# EAGLE design AR9721_eval (EAGLE 9.3.2)

## Sheet 1 of 3: AR9271
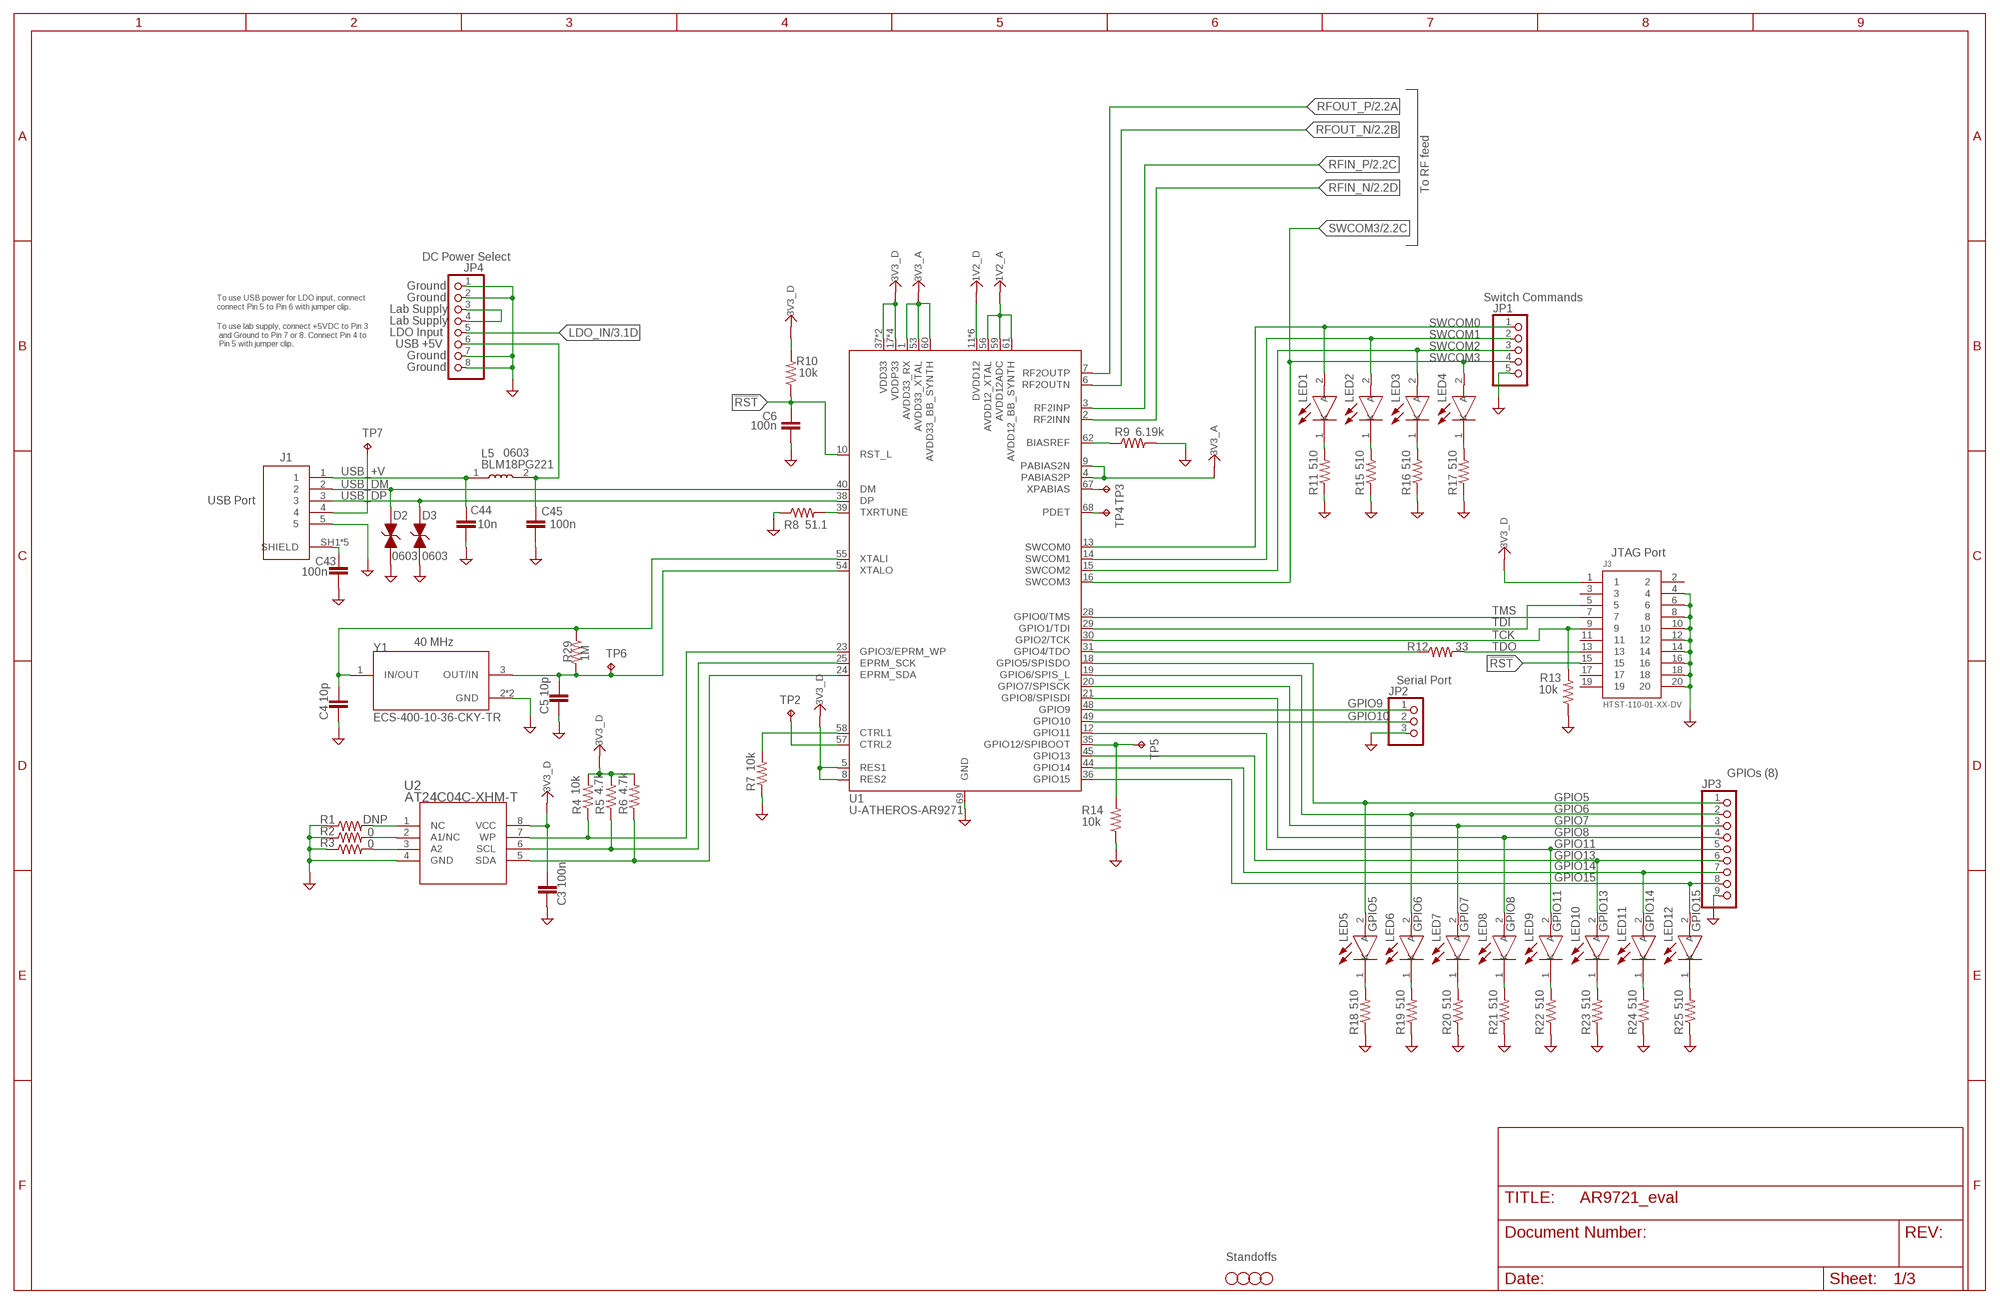
[diagram p0: schematic, sheet 1]

### Parts
C3  100n  C-EU0402-B-NOSILK  [.0402-B-NOSILK]
C4  10p  C-EU0402-B-NOSILK  [.0402-B-NOSILK]
C5  10p  C-EU0402-B-NOSILK  [.0402-B-NOSILK]
C6  100n  C-EU0402-B-NOSILK  [.0402-B-NOSILK]
C43  100n  C-EU0402-B-NOSILK  [.0402-B-NOSILK]
C44  10n  C-EU0402-B-NOSILK  [.0402-B-NOSILK]
C45  100n  C-EU0402-B-NOSILK  [.0402-B-NOSILK]
D2  PGB1010603MR  [ESD_PGB1010603MR]
D3  PGB1010603MR  [ESD_PGB1010603MR]
H1  STAND-OFFTIGHT  [STAND-OFF-TIGHT]
H2  STAND-OFFTIGHT  [STAND-OFF-TIGHT]
H3  STAND-OFFTIGHT  [STAND-OFF-TIGHT]
H4  STAND-OFFTIGHT  [STAND-OFF-TIGHT]
J1  UJ2-MIBH2-4-SMT-TR  [CUI_UJ2-MIBH2-4-SMT-TR]
J3  HTST-110-01-XX-DV  [HTST-110-01-XX-DV]
JP1  PINHD-1X5  [1X05]
JP2  PINHD-1X3  [1X03]
JP3  PINHD-1X9  [1X09]
JP4  PINHD-1X8  [1X08]
L5  BLM18PG221SH1D  [INDC1608X95]
LED1  LTST-C193KGKT-5A  [LEDC1607X80N]
LED2  LTST-C193KGKT-5A  [LEDC1607X80N]
LED3  LTST-C193KGKT-5A  [LEDC1607X80N]
LED4  LTST-C193KGKT-5A  [LEDC1607X80N]
LED5  LTST-C193KGKT-5A  [LEDC1607X80N]
LED6  LTST-C193KGKT-5A  [LEDC1607X80N]
LED7  LTST-C193KGKT-5A  [LEDC1607X80N]
LED8  LTST-C193KGKT-5A  [LEDC1607X80N]
LED9  LTST-C193KGKT-5A  [LEDC1607X80N]
LED10  LTST-C193KGKT-5A  [LEDC1607X80N]
LED11  LTST-C193KGKT-5A  [LEDC1607X80N]
LED12  LTST-C193KGKT-5A  [LEDC1607X80N]
R1  DNP  R-US_0402-A-NOSILK  [.0402-A-NOSILK]
R2  0  R-US_0402-A-NOSILK  [.0402-A-NOSILK]
R3  0  R-US_0402-A-NOSILK  [.0402-A-NOSILK]
R4  10k  R-US_0402-A-NOSILK  [.0402-A-NOSILK]
R5  4.7k  R-US_0402-A-NOSILK  [.0402-A-NOSILK]
R6  4.7k  R-US_0402-A-NOSILK  [.0402-A-NOSILK]
R7  10k  R-US_0402-A-NOSILK  [.0402-A-NOSILK]
R8  51.1  R-US_0402-A-NOSILK  [.0402-A-NOSILK]
R9  6.19k  R-US_0402-A-NOSILK  [.0402-A-NOSILK]
R10  10k  R-US_0402-A-NOSILK  [.0402-A-NOSILK]
R11  510  R-US_0402-A-NOSILK  [.0402-A-NOSILK]
R12  33  R-US_0402-A-NOSILK  [.0402-A-NOSILK]
R13  10k  R-US_0402-A-NOSILK  [.0402-A-NOSILK]
R14  10k  R-US_0402-A-NOSILK  [.0402-A-NOSILK]
R15  510  R-US_0402-A-NOSILK  [.0402-A-NOSILK]
R16  510  R-US_0402-A-NOSILK  [.0402-A-NOSILK]
R17  510  R-US_0402-A-NOSILK  [.0402-A-NOSILK]
R18  510  R-US_0402-A-NOSILK  [.0402-A-NOSILK]
R19  510  R-US_0402-A-NOSILK  [.0402-A-NOSILK]
R20  510  R-US_0402-A-NOSILK  [.0402-A-NOSILK]
R21  510  R-US_0402-A-NOSILK  [.0402-A-NOSILK]
R22  510  R-US_0402-A-NOSILK  [.0402-A-NOSILK]
R23  510  R-US_0402-A-NOSILK  [.0402-A-NOSILK]
R24  510  R-US_0402-A-NOSILK  [.0402-A-NOSILK]
R25  510  R-US_0402-A-NOSILK  [.0402-A-NOSILK]
R29  1M  R-US_0402-A-NOSILK  [.0402-A-NOSILK]
TP2  TPTP06R  [TP06R]
TP3  TPTP06R  [TP06R]
TP4  TPTP06R  [TP06R]
TP5  TPTP06R  [TP06R]
TP6  TPTP06R  [TP06R]
TP7  TPTP06R  [TP06R]
U1  U-ATHEROS-AR9271  [QFN-68]
U2  AT24C04C-XHM-T  [8X]
Y1  ECS-400-10-36-CKY-TR  [XTAL_ECS-400-10-36-CKY-TR]

### Nets
1V2_A: U1.56(AVDD12_XTAL) U1.59(AVDD12ADC) U1.61(AVDD12_BB_SYNTH) ; also sheet 3
1V2_D: U1.11(DVDD12) U1.22(DVDD12) U1.27(DVDD12) U1.42(DVDD12) U1.43(DVDD12) U1.46(DVDD12) ; also sheet 3
3V3_A: U1.1(AVDD33_RX) U1.4(PABIAS2P) U1.9(PABIAS2N) U1.53(AVDD33_XTAL) U1.60(AVDD33_BB_SYNTH) ; also sheet 3
3V3_D: C3.1 J3.1 R4.2 R5.2 R6.2 R10.2 U1.5(RES1) U1.8(RES2) U1.17(VDDP33) U1.26(VDDP33) U1.33(VDDP33) U1.37(VDD33) U1.41(VDD33) U1.47(VDDP33) U2.8(VCC) ; also sheet 3
!RST: C6.1 J3.15 R10.1 U1.10(RST_L)
A1: R2.2 U2.2(A1/NC)
A2: R3.2 U2.3(A2)
BIASREF: R9.1 U1.62(BIASREF)
CTRL1: R7.2 U1.58(CTRL1)
CTRL2: TP2.TP U1.57(CTRL2)
EE-SCK: R5.1 U1.25(EPRM_SCK) U2.6(SCL)
EE-SDA: R6.1 U1.24(EPRM_SDA) U2.5(SDA)
EE-WP: R4.1 U1.23(GPIO3/EPRM_WP) U2.7(WP)
GND: C3.2 C4.2 C5.2 C6.2 C43.2 C44.2 C45.2 D2.2 D3.2 J1.5 J3.4 J3.6 J3.8 J3.10 J3.12 J3.14 J3.16 J3.18 J3.20 JP1.5 JP2.3 JP3.9 JP4.1 JP4.2 JP4.7 JP4.8 R1.1 R2.1 R3.1 R7.1 R8.1 R9.2 R11.1 R13.1 R14.1 R15.1 R16.1 R17.1 R18.1 R19.1 R20.1 R21.1 R22.1 R23.1 R24.1 R25.1 U1.69(GND) U2.4(GND) Y1.2(GND) Y1.4(GND) ; also sheet 2,3
GPIO5: JP3.1 LED5.2(A) U1.18(GPIO5/SPISDO)
GPIO6: JP3.2 LED6.2(A) U1.19(GPIO6/SPIS_L)
GPIO7: JP3.3 LED7.2(A) U1.20(GPIO7/SPISCK)
GPIO8: JP3.4 LED8.2(A) U1.21(GPIO8/SPISDI)
GPIO9: JP2.1 U1.48(GPIO9)
GPIO10: JP2.2 U1.49(GPIO10)
GPIO11: JP3.5 LED9.2(A) U1.12(GPIO11)
GPIO13: JP3.6 LED10.2(A) U1.45(GPIO13)
GPIO14: JP3.7 LED11.2(A) U1.44(GPIO14)
GPIO15: JP3.8 LED12.2(A) U1.36(GPIO15)
LDO_IN: JP4.5 ; also sheet 3
N$1: J1.4 TP7.TP
N$6: JP4.3 JP4.4
N$7: R1.2 U2.1(NC)
N$12: LED1.1(K) R11.2
N$13: LED2.1(K) R15.2
N$19: LED3.1(K) R16.2
N$20: LED4.1(K) R17.2
N$21: LED5.1(K) R18.2
N$26: LED6.1(K) R19.2
N$27: LED7.1(K) R20.2
N$28: LED8.1(K) R21.2
N$29: LED9.1(K) R22.2
N$30: C43.1 J1.SH1(SHIELD) J1.SH2(SHIELD) J1.SH3(SHIELD) J1.SH4(SHIELD) J1.SH5(SHIELD)
N$34: LED10.1(K) R23.2
N$35: LED11.1(K) R24.2
N$36: LED12.1(K) R25.2
PDET: TP4.TP U1.68(PDET)
RFIN_N [RF1]: U1.2(RF2INN) ; also sheet 2
RFIN_P [RF1]: U1.3(RF2INP) ; also sheet 2
RFOUT_N [RF1]: U1.6(RF2OUTN) ; also sheet 2
RFOUT_P [RF1]: U1.7(RF2OUTP) ; also sheet 2
SPIBOOT: R14.2 TP5.TP U1.35(GPIO12/SPIBOOT)
SWCOM0: JP1.1 LED1.2(A) U1.13(SWCOM0)
SWCOM1: JP1.2 LED2.2(A) U1.14(SWCOM1)
SWCOM2: JP1.3 LED3.2(A) U1.15(SWCOM2)
SWCOM3: JP1.4 LED4.2(A) U1.16(SWCOM3) ; also sheet 2
TCK: J3.9 R13.2 U1.30(GPIO2/TCK)
TDI: J3.5 U1.29(GPIO1/TDI)
TDO: J3.13 R12.2
TDO-PRE-RES: R12.1 U1.31(GPIO4/TDO)
TMS: J3.7 U1.28(GPIO0/TMS)
TXRTUNE: R8.2 U1.39(TXRTUNE)
USB+5V: C45.1 JP4.6 L5.2
USB_+V: C44.1 J1.1 L5.1
USB_DM: D2.1 J1.2 U1.40(DM)
USB_DP: D3.1 J1.3 U1.38(DP)
XPABIOS: TP3.TP U1.67(XPABIAS)
XTALI: C4.1 R29.1 U1.55(XTALI) Y1.1(IN/OUT)
XTALO: C5.1 R29.2 TP6.TP U1.54(XTALO) Y1.3(OUT/IN)
Unconnected: J3.2 J3.3 J3.11 J3.17 J3.19

### Notes on the sheet
- To RF feed
- DC Power Select
- Ground
- Ground | Switch Commands
- To use USB power for LDO input, connect
  connect Pin 5 to Pin 6 with jumper clip.
- Lab Supply
- Lab Supply
- LDO Input
- To use lab supply, connect +5VDC to Pin 3
   and Ground to Pin 7 or 8. Connect Pin 4 to
   Pin 5 with jumper clip.
- USB +5V
- Ground
- Ground
- 0603
- BLM18PG221
- USB Port
- JTAG Port
- 0603 | 0603
- 40 MHz
- Serial Port
- GPIOs (8)
- Standoffs

## Sheet 2 of 3: RF feed
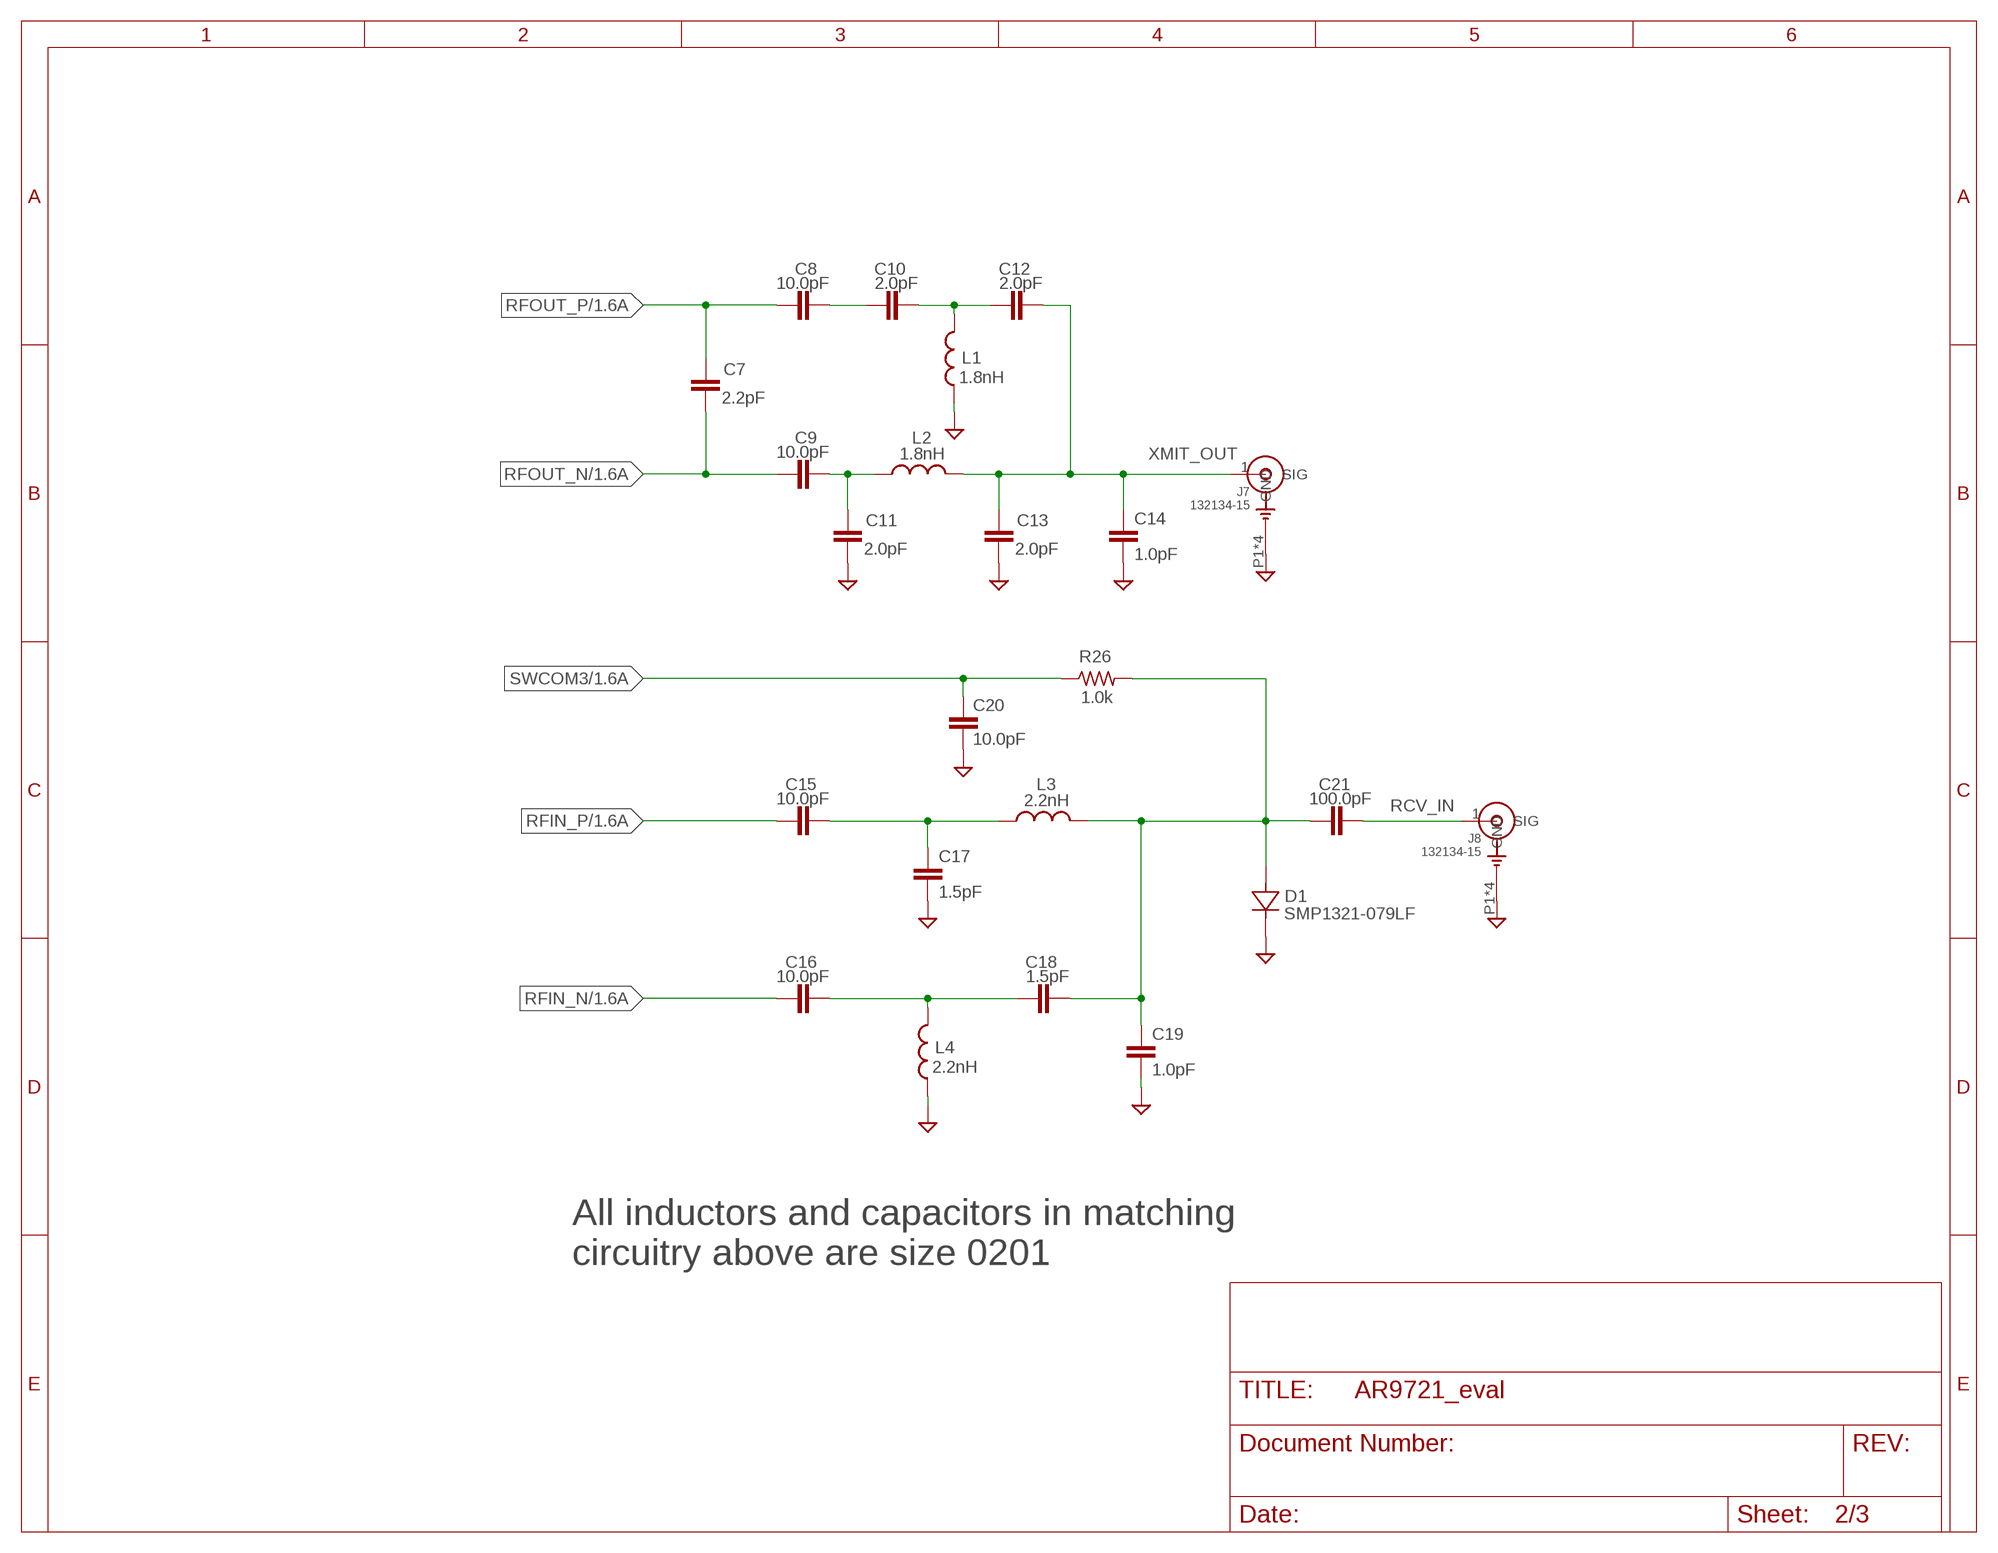
[diagram p1: schematic, sheet 2]

### Parts
C7  2.2pF  C-EU0201-B-NOSILK  [.0201-B-NOSILK]
C8  10.0pF  C-EU0201-B-NOSILK  [.0201-B-NOSILK]
C9  10.0pF  C-EU0201-B-NOSILK  [.0201-B-NOSILK]
C10  2.0pF  C-EU0201-B-NOSILK  [.0201-B-NOSILK]
C11  2.0pF  C-EU0201-B-NOSILK  [.0201-B-NOSILK]
C12  2.0pF  C-EU0201-B-NOSILK  [.0201-B-NOSILK]
C13  2.0pF  C-EU0201-B-NOSILK  [.0201-B-NOSILK]
C14  1.0pF  C-EU0201-B-NOSILK  [.0201-B-NOSILK]
C15  10.0pF  C-EU0201-B-NOSILK  [.0201-B-NOSILK]
C16  10.0pF  C-EU0201-B-NOSILK  [.0201-B-NOSILK]
C17  1.5pF  C-EU0201-B-NOSILK  [.0201-B-NOSILK]
C18  1.5pF  C-EU0201-B-NOSILK  [.0201-B-NOSILK]
C19  1.0pF  C-EU0201-B-NOSILK  [.0201-B-NOSILK]
C20  10.0pF  C-EU0201-B-NOSILK  [.0201-B-NOSILK]
C21  100.0pF  C-EU0201-B-NOSILK  [.0201-B-NOSILK]
D1  SMP1321-079LF  [SOD523]
J7  132134-15  [AMPHENOL_132134-15]
J8  132134-15  [AMPHENOL_132134-15]
L1  1.8nH  L-US0201-B-NOSILK  [.0201-B-NOSILK]
L2  1.8nH  L-US0201-B-NOSILK  [.0201-B-NOSILK]
L3  2.2nH  L-US0201-B-NOSILK  [.0201-B-NOSILK]
L4  2.2nH  L-US0201-B-NOSILK  [.0201-B-NOSILK]
R26  1.0k  R-US_0201-B-NOSILK  [.0201-B-NOSILK]

### Nets
GND: C11.1 C13.1 C14.2 C17.2 C19.2 C20.2 D1.1 J7.P1(GND) J7.P2(GND) J7.P3(GND) J7.P4(GND) J8.P1(GND) J8.P2(GND) J8.P3(GND) J8.P4(GND) L1.1 L4.1 ; also sheet 1,3
N$14 [RF1]: C10.2 C12.1 L1.2
N$15: C15.2 C17.1 L3.1
N$17 [RF1]: C16.2 C18.1 L4.2
N$18 [RF1]: C9.2 C11.2 L2.1
N$22 [RF1]: C8.2 C10.1
N$24 [RF1]: C18.2 C19.1 C21.1 D1.2 L3.2 R26.2
RCV_IN [RF1]: C21.2 J8.1(SIG)
RFIN_N [RF1]: C16.1 ; also sheet 1
RFIN_P [RF1]: C15.1 ; also sheet 1
RFOUT_N [RF1]: C7.1 C9.1 ; also sheet 1
RFOUT_P [RF1]: C7.2 C8.1 ; also sheet 1
SWCOM3: C20.1 R26.1 ; also sheet 1
XMIT_OUT [RF1]: C12.2 C13.2 C14.1 J7.1(SIG) L2.2

### Notes on the sheet
- All inductors and capacitors in matching
  circuitry above are size 0201

## Sheet 3 of 3: POWER
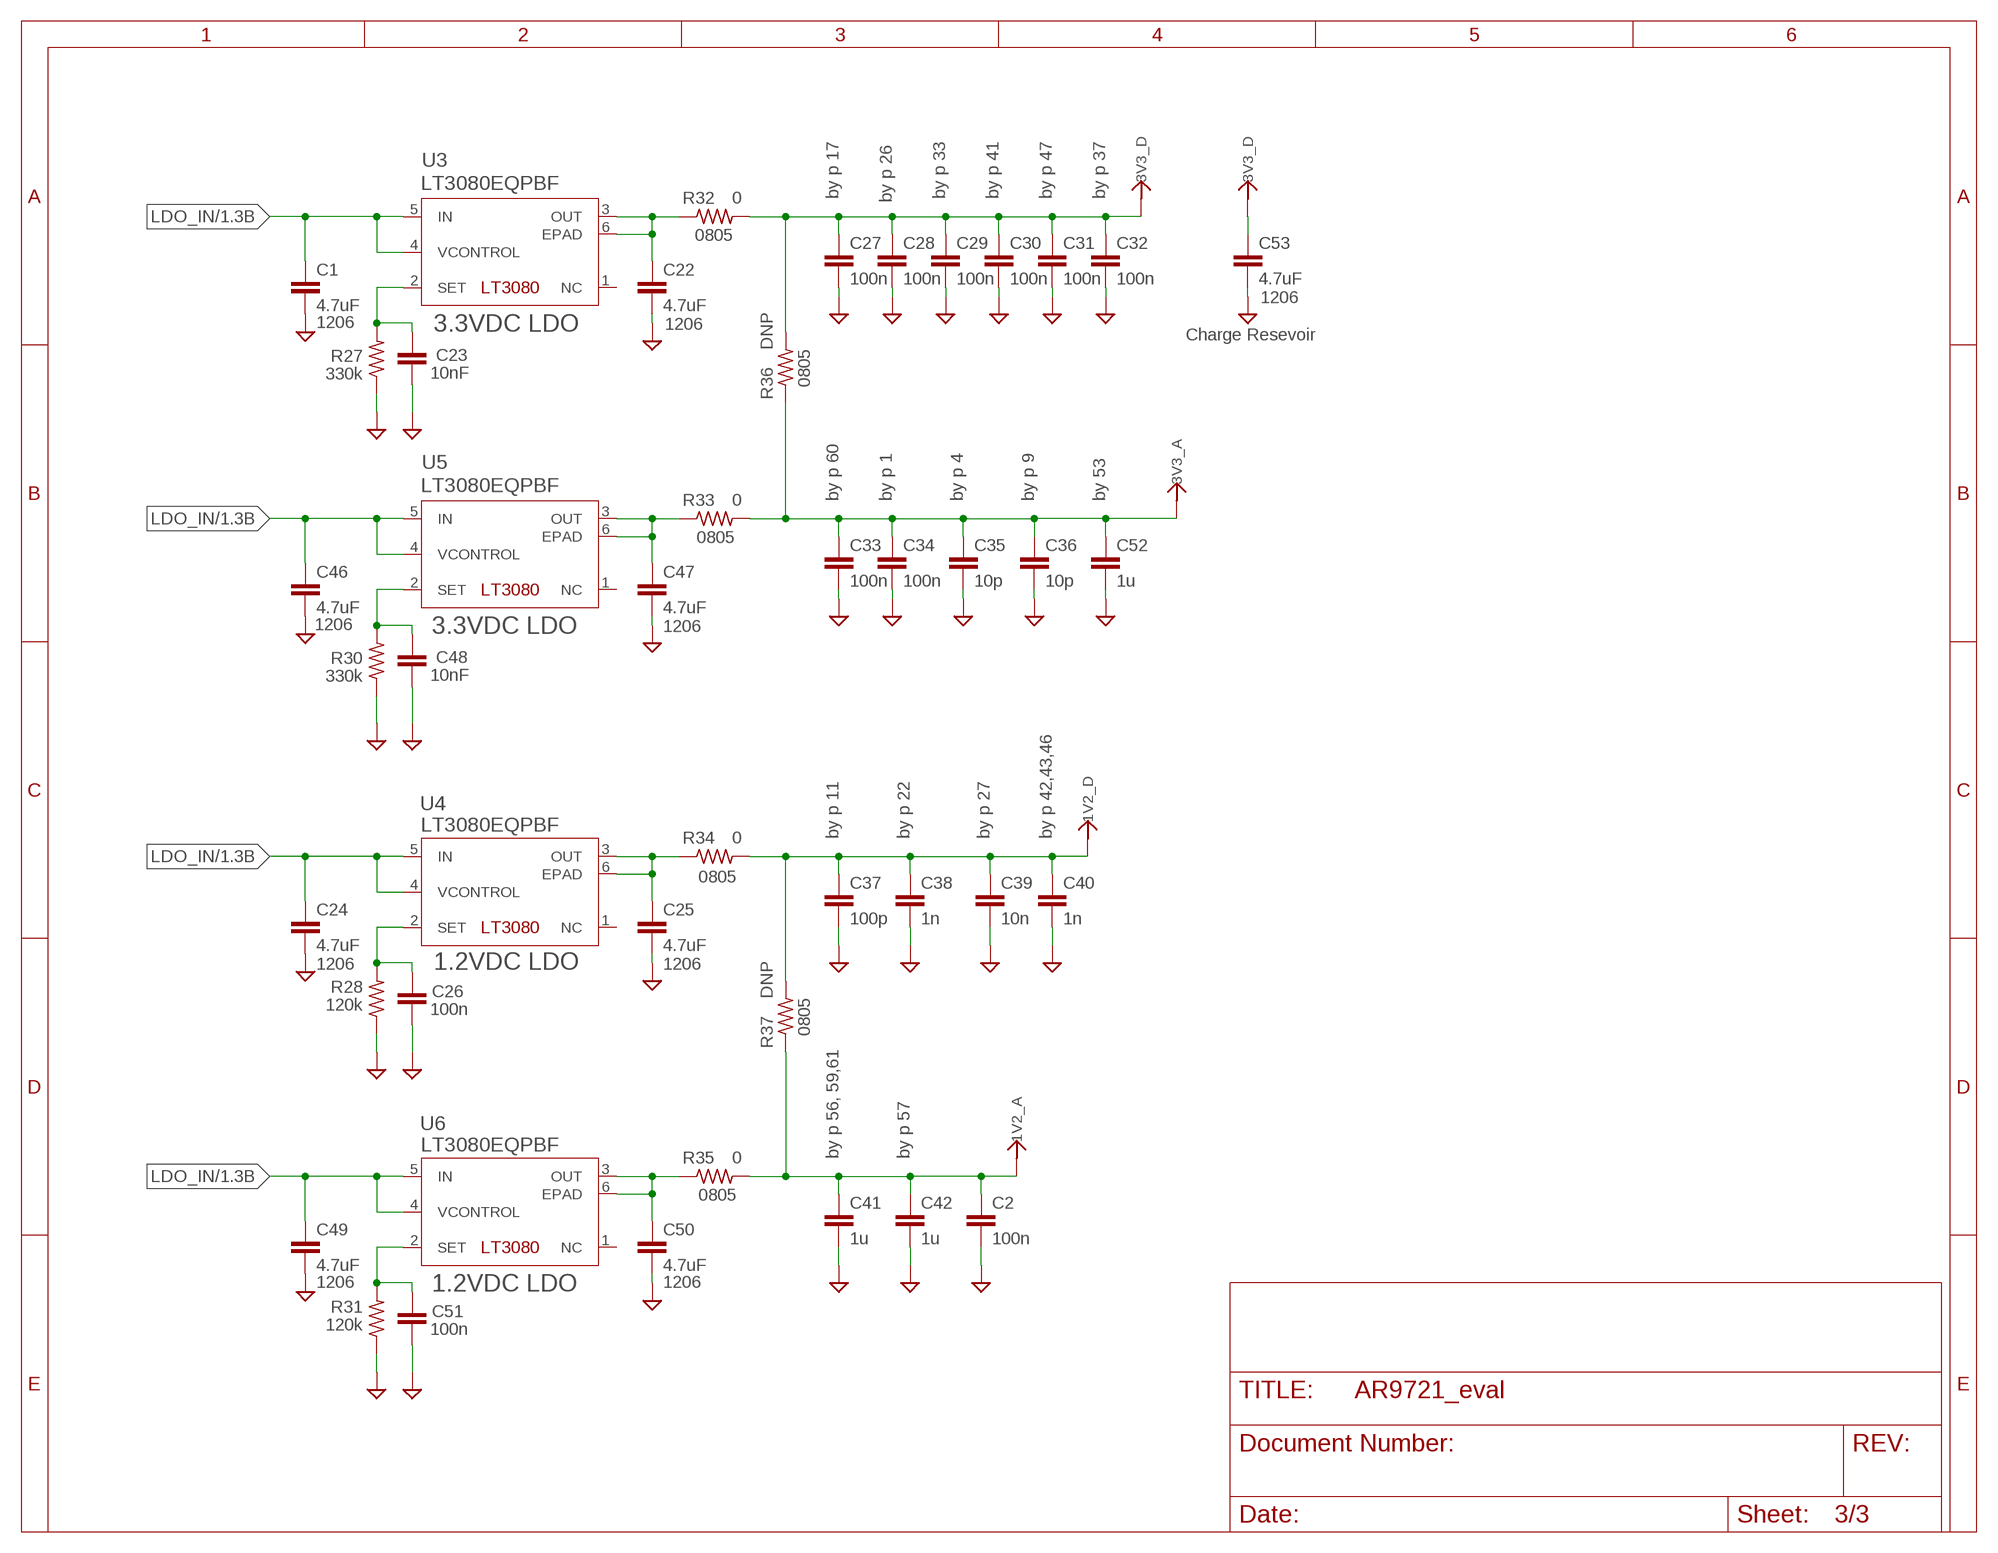
[diagram p2: schematic, sheet 3]

### Parts
C1  4.7uF  C-EUC1206  [C1206]
C2  100n  C-EU0402-B-NOSILK  [.0402-B-NOSILK]
C22  4.7uF  C-EUC1206  [C1206]
C23  10nF  C-EU0402-B-NOSILK  [.0402-B-NOSILK]
C24  4.7uF  C-EUC1206  [C1206]
C25  4.7uF  C-EUC1206  [C1206]
C26  100n  C-EU0402-B-NOSILK  [.0402-B-NOSILK]
C27  100n  C-EU0402-B-NOSILK  [.0402-B-NOSILK]
C28  100n  C-EU0402-B-NOSILK  [.0402-B-NOSILK]
C29  100n  C-EU0402-B-NOSILK  [.0402-B-NOSILK]
C30  100n  C-EU0402-B-NOSILK  [.0402-B-NOSILK]
C31  100n  C-EU0402-B-NOSILK  [.0402-B-NOSILK]
C32  100n  C-EU0402-B-NOSILK  [.0402-B-NOSILK]
C33  100n  C-EU0402-B-NOSILK  [.0402-B-NOSILK]
C34  100n  C-EU0402-B-NOSILK  [.0402-B-NOSILK]
C35  10p  C-EU0402-B-NOSILK  [.0402-B-NOSILK]
C36  10p  C-EU0402-B-NOSILK  [.0402-B-NOSILK]
C37  100p  C-EU0402-B-NOSILK  [.0402-B-NOSILK]
C38  1n  C-EU0402-B-NOSILK  [.0402-B-NOSILK]
C39  10n  C-EU0402-B-NOSILK  [.0402-B-NOSILK]
C40  1n  C-EU0402-B-NOSILK  [.0402-B-NOSILK]
C41  1u  C-EU0402-B-NOSILK  [.0402-B-NOSILK]
C42  1u  C-EU0402-B-NOSILK  [.0402-B-NOSILK]
C46  4.7uF  C-EUC1206  [C1206]
C47  4.7uF  C-EUC1206  [C1206]
C48  10nF  C-EU0402-B-NOSILK  [.0402-B-NOSILK]
C49  4.7uF  C-EUC1206  [C1206]
C50  4.7uF  C-EUC1206  [C1206]
C51  100n  C-EU0402-B-NOSILK  [.0402-B-NOSILK]
C52  1u  C-EU0402-B-NOSILK  [.0402-B-NOSILK]
C53  4.7uF  C-EUC1206  [C1206]
R27  330k  R-US_0402-A-NOSILK  [.0402-A-NOSILK]
R28  120k  R-US_0402-A-NOSILK  [.0402-A-NOSILK]
R30  330k  R-US_0402-A-NOSILK  [.0402-A-NOSILK]
R31  120k  R-US_0402-A-NOSILK  [.0402-A-NOSILK]
R32  0  R-US_0805-B  [.0805-B]
R33  0  R-US_0805-B  [.0805-B]
R34  0  R-US_0805-B  [.0805-B]
R35  0  R-US_0805-B  [.0805-B]
R36  DNP  R-US_0805-B  [.0805-B]
R37  DNP  R-US_0805-B  [.0805-B]
U3  LT3080EQPBF  [DDPAK-5_Q]
U4  LT3080EQPBF  [DDPAK-5_Q]
U5  LT3080EQPBF  [DDPAK-5_Q]
U6  LT3080EQPBF  [DDPAK-5_Q]

### Nets
1V2_A: C2.1 C41.1 C42.1 R35.2 R37.1 ; also sheet 1
1V2_D: C37.1 C38.1 C39.1 C40.1 R34.2 R37.2 ; also sheet 1
3V3_A: C33.1 C34.1 C35.1 C36.1 C52.1 R33.2 R36.1 ; also sheet 1
3V3_D: C27.1 C28.1 C29.1 C30.1 C31.1 C32.1 C53.1 R32.2 R36.2 ; also sheet 1
GND: C1.2 C2.2 C22.2 C23.2 C24.2 C25.2 C26.2 C27.2 C28.2 C29.2 C30.2 C31.2 C32.2 C33.2 C34.2 C35.2 C36.2 C37.2 C38.2 C39.2 C40.2 C41.2 C42.2 C46.2 C47.2 C48.2 C49.2 C50.2 C51.2 C52.2 C53.2 R27.1 R28.1 R30.1 R31.1 ; also sheet 1,2
LDO_IN: C1.1 C24.1 C46.1 C49.1 U3.4(VCONTROL) U3.5(IN) U4.4(VCONTROL) U4.5(IN) U5.4(VCONTROL) U5.5(IN) U6.4(VCONTROL) U6.5(IN) ; also sheet 1
N$23: C23.1 R27.2 U3.2(SET)
N$25: C26.1 R28.2 U4.2(SET)
N$33: C22.1 R32.1 U3.3(OUT) U3.6(EPAD)
N$37: C25.1 R34.1 U4.3(OUT) U4.6(EPAD)
N$43: C48.1 R30.2 U5.2(SET)
N$44: C47.1 R33.1 U5.3(OUT) U5.6(EPAD)
N$46: C51.1 R31.2 U6.2(SET)
N$47: C50.1 R35.1 U6.3(OUT) U6.6(EPAD)
Unconnected: U3.1(NC) U4.1(NC) U5.1(NC) U6.1(NC)

### Notes on the sheet
- by p 17 | by p 26 | by p 33 | by p 41 | by p 47 | by p 37
- 0805
- 1206
- 1206 | 3.3VDC LDO | 1206
- Charge Resevoir
- 0805
- by p 60 | by p 1 | by p 4 | by p 9 | by 53
- 0805
- 1206 | 3.3VDC LDO | 1206
- by p 11 | by p 22 | by p 27 | by p 42,43,46
- 0805
- 1206 | 1.2VDC LDO | 1206
- 0805
- by p 56, 59,61 | by p 57
- 0805
- 1206 | 1.2VDC LDO | 1206

## Library data of the parts
C1 C22 C24 C25 C46 C47 C49 C50 C53 = rcl:C-EU: CAPACITOR, European symbol; MPN: GCM31CR71C475KA37L; SPICEPREFIX: C
C2 C41 C42 = oresat-rcl:C-EU: CAPACITOR, European symbol; MPN: GRM155R70J105KA12J
C3 C6 C26-C34 C43 C45 C51 = oresat-rcl:C-EU: CAPACITOR, European symbol; MPN: CGA2B1X7R1C104K050BC
C4 C5 = oresat-rcl:C-EU: CAPACITOR, European symbol
C7 = oresat-rcl:C-EU: CAPACITOR, European symbol; MPN: UMK063CG2R2CTHF
C8 C9 C15 C16 C20 = oresat-rcl:C-EU: CAPACITOR, European symbol; MPN: UMK063CG100DTHF
C10-C13 = oresat-rcl:C-EU: CAPACITOR, European symbol; MPN: UMK063CG020CTHF
C14 C19 = oresat-rcl:C-EU: CAPACITOR, European symbol; MPN: UMK063CG010CTHF
C17 C18 = oresat-rcl:C-EU: CAPACITOR, European symbol; MPN: UMK063CG1R5CT-F
C21 = oresat-rcl:C-EU: CAPACITOR, European symbol; MPN: UMK063CG101JT-F
C23 C39 C44 C48 = oresat-rcl:C-EU: CAPACITOR, European symbol; MPN: C0402C103K4RACAUTO
C35 C36 C52 = oresat-rcl:C-EU: CAPACITOR, European symbol; MPN: CGA2B2C0G1H100D050BA
C37 = oresat-rcl:C-EU: CAPACITOR, European symbol; MPN: CGA2B2C0G1H101J050BA
C38 C40 = oresat-rcl:C-EU: CAPACITOR, European symbol; MPN: C0402C102K5GACTU
D1 = SMP1321-079LF:SMP1321-079LF: RF PIN Diode; MPN: SMP1321-079
D2 D3 = PGB1010603MR_Snap:PGB1010603MR: PGB1 Series 15 V 63 Bi-Directional Surface Mount PulseGuard® ESD Suppressor; DESCRIPTION: PGB1 Series 15 V 63 Bi-Directional Surface Mount PulseGuard® ESD Suppressor; DIGI-KEY_PART_NUMBER: F2594CT-ND; DIGI-KEY_PURCHASE_URL: https://www.digikey.com/product-detail/en/littelfuse-inc/PGB1010603MR/F2594CT-ND/813072?utm_source=snapeda&utm_medium=aggregator&utm_campaign=symbol; MF: Littelfuse Inc.; MPN: PGB1010603MR; PACKAGE: 0603 Littelfuse
H1-H4 = SparkFun-Hardware:STAND-OFF: Stand Off Drill holes for mechanically mounting via screws, standoffs, etc. Note: Use the keepout ring to avoid running the screw head into surrounding components. Variant Overviews STAND-OFF - Mechanical footprint for a #4 phillips button head screw. STAND-OFF-TIGHT - Mechanical footprint for a #4 phillips button head screw, Example SparkFun Products Screw - Phillips Head (1/4", 4-40, 10 pack) <https://www.sparkfun.com/products/10453> (PRT-10453) Screw - Phillips Head (1/2", 4-40, 10 pack) <https://www.sparkfun.com/products/10452> (PRT-10452) Screw - Phillips Head (3/4", 4-40, 10 pack) <https://www.sparkfun.com/products/10451> (PRT-10451) Screw - Phillips Head (1", 4-40, 10 pack) <https://www.sparkfun.com/products/10450> (PRT-10450)
J1 = UJ2-MIBH2-4-SMT-TR:UJ2-MIBH2-4-SMT-TR: Micro B Type 5 Pin Horizontal 30 µin Plating SMT USB Jack 2.0; CUI_PURCHASE_URL: https://www.cui.com/product/interconnect/usb-connectors/micro-b/uj2-mibh2-4-smt?utm_source=snapeda.com&utm_medium=referral&utm_campaign=snapedaBOM; DESCRIPTION: Micro B Type 5 Pin Horizontal 30 µin Plating SMT USB Jack 2.0; DIGI-KEY_PART_NUMBER: 102-4007-1-ND; DIGI-KEY_PURCHASE_URL: https://www.digikey.com/product-detail/en/cui-inc/UJ2-MIBH2-4-SMT-TR/102-4007-1-ND/6187929?utm_source=snapeda&utm_medium=aggregator&utm_campaign=symbol; MF: CUI Inc.; MP: UJ2-MIBH2-4-SMT-TR; MPN: UJ2-MIBH2-4-SMT-TR; PACKAGE: None
J3 = HTST-110-01-XX-DV:HTST-110-01-XX-DV: HIGH TEMP TOP SHROUD.; DESCRIPTION: Conn Shrouded Header HDR 20 POS 2.54mm Solder ST SMD Tube; MF: Samtec Inc.; MPN: HTST-110-01-L-DV-P; PACKAGE: None; PRICE: None
J7 J8 = 132134-15:132134-15: Rf Coaxial, Sma, Straight Jack, Pcb; DESCRIPTION: Rf Coaxial, Sma, Straight Jack, Pcb; DIGI-KEY_PART_NUMBER: ACX1962-ND; DIGI-KEY_PURCHASE_URL: https://www.digikey.com/product-detail/en/amphenol-rf-division/132134-15/ACX1962-ND/3088347?utm_source=snapeda&utm_medium=aggregator&utm_campaign=symbol; MF: Amphenol RF; MPN: 132134-15; PACKAGE: None
JP1 = pinhead:PINHD-1X5: PIN HEADER
JP2 = pinhead:PINHD-1X3: PIN HEADER
JP3 = pinhead:PINHD-1X9: PIN HEADER
JP4 = pinhead:PINHD-1X8: PIN HEADER
L1 L2 = oresat-rcl:L-US: INDUCTOR, American symbol; MPN: LQP03TN1N8B02D
L3 L4 = oresat-rcl:L-US: INDUCTOR, American symbol; MPN: LQP03TN2N2B02D
L5 = BLM18PG221SH1D:BLM18PG221SH1D: FERRITE BEAD 220 OHM 0603 1LN; DESCRIPTION: BLM Series 0603 220 Ohm 1.4 A 0.1 Ohm DCR Surface Mount Ferrite Bead; DIGI-KEY_PART_NUMBER: 490-7817-1-ND; DIGI-KEY_PURCHASE_URL: https://www.digikey.com/product-detail/en/murata-electronics-north-america/BLM18PG221SH1D/490-7817-1-ND/4380156?utm_source=snapeda&utm_medium=aggregator&utm_campaign=symbol; MF: Murata Electronics; MPN: BLM18PG221SH1D; PACKAGE: 0603 Murata
LED1-LED12 = SamacSys_Parts:LTST-C193KGKT-5A: LED,SMD,0603,Green, Lite-On LTST-C193KGKT-5A 1608 (0603), Rectangle Lens SMD Package Source: Datasheet <http://docs-europe.electrocomponents.com/webdocs/0dc0/0900766b80dc02a7.pdf>; DESCRIPTION: LED,SMD,0603,Green,Lite-On 1608 (0603), Rectangle Lens SMD Package; MFR: Lite-On; MPN: LTST-C193KGKT-5A
R1-R3 = oresat-rcl:R-US_: RESISTOR, American symbol; MPN: ERJ-2GE0R00X
R4-R7 R10 R13 R14 = oresat-rcl:R-US_: RESISTOR, American symbol; MPN: ERJ-2GEJ103X
R8 = oresat-rcl:R-US_: RESISTOR, American symbol; MPN: ERJ-2RKF51R1X
R9 = oresat-rcl:R-US_: RESISTOR, American symbol; MPN: ERJ-2RKF6191X
R11 R15-R25 = oresat-rcl:R-US_: RESISTOR, American symbol; MPN: ERJ-2GEJ511X
R12 = oresat-rcl:R-US_: RESISTOR, American symbol; MPN: ERJ-2GEJ330X
R26 = oresat-rcl:R-US_: RESISTOR, American symbol; MPN: ERJ-1GNF1001C
R27 R30 = oresat-rcl:R-US_: RESISTOR, American symbol; MPN: ERJ-2RKF3303X
R28 R31 = oresat-rcl:R-US_: RESISTOR, American symbol; MPN: ERJ-2RKF1203X
R29 = oresat-rcl:R-US_: RESISTOR, American symbol; MPN: ERJ-2GEJ105X
R32-R37 = oresat-rcl:R-US_: RESISTOR, American symbol; MPN: ERJ-6GEY0R00V
TP2-TP7 = testpad:TP: Test pad
U1 = U-Atheros-AR9271-WiFi-adapter:U-ATHEROS-AR9271: Atheros WiFi WLAN device; MPN: AR9271
U2 = U-Generic-AT24C04-EEPROM-I2C-4Kb-TSSOP:AT24C04C-XHM-T: EEPROM with I2C interface; MANUFACTURER_PART_NUMBER: AT24C04CXHMT; VENDOR: Atmel
U3-U6 = U-LT3080EQ:LT3080EQPBF; MANUFACTURER_PART_NUMBER: LT3080EQ#PBF; VENDOR: Linear Technology
Y1 = ECS-400-10-36-CKY-TR:ECS-400-10-36-CKY-TR: The minature ECX-2236 is a compact SMD Crystal. The industry standard 2.5 x 2.0 x 0.55 mm ceramic package is ideal for today’s SMD manufacturing environment.; DESCRIPTION: Crystal 40mhz 10pf Smd; DIGI-KEY_PART_NUMBER: XC2666CT-ND; DIGI-KEY_PURCHASE_URL: https://www.digikey.com/product-detail/en/ecs-inc/ECS-400-10-36-CKY-TR/XC2666CT-ND/8023601?utm_source=snapeda&utm_medium=aggregator&utm_campaign=symbol; MF: ECS International; MP: ECS-400-10-36-CKY-TR; PACKAGE: SMD-4 ECS International

## Net classes
1 RF1: width 0.38 mm, clearance 0.75 mm

## Board
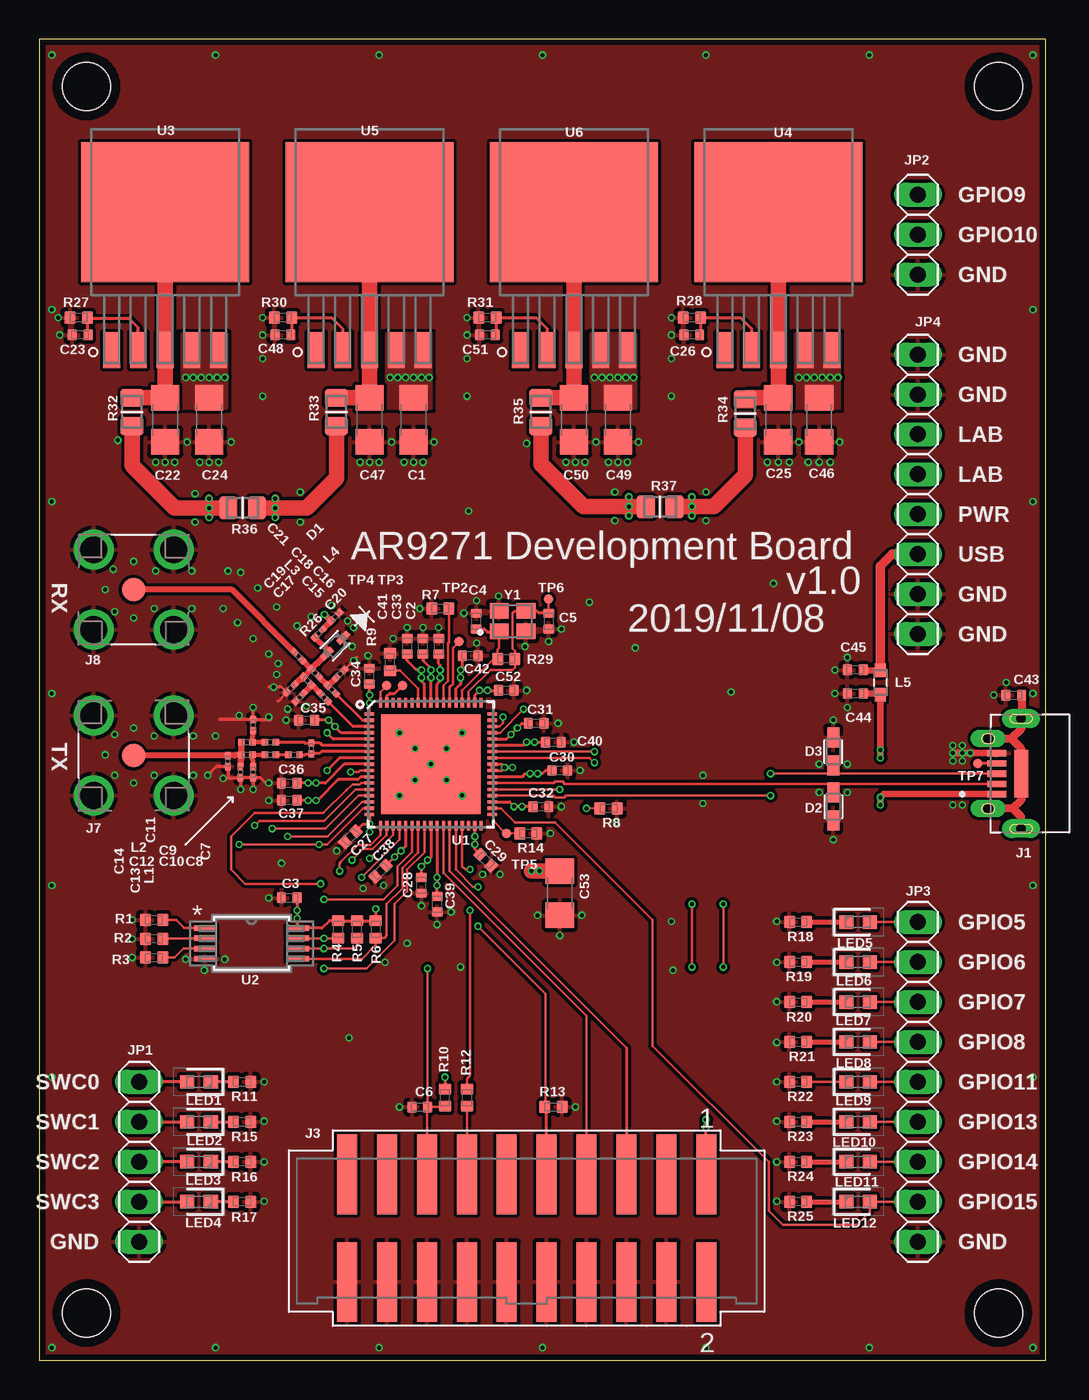
[diagram p3: board, top side]
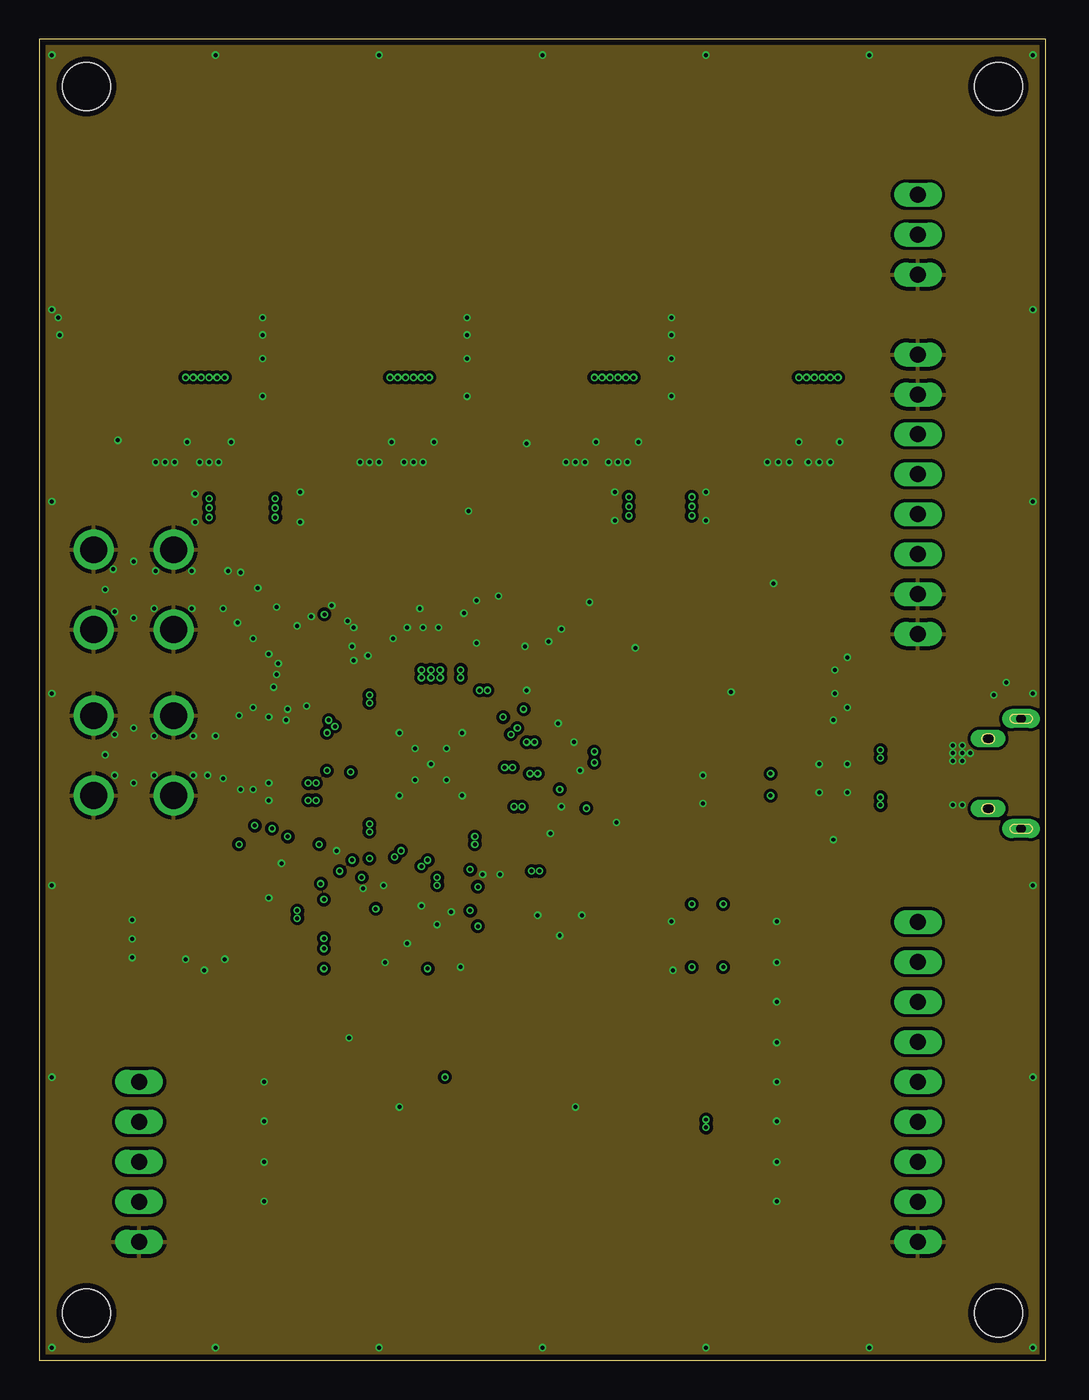
[diagram p4: board, inner layer Route2]
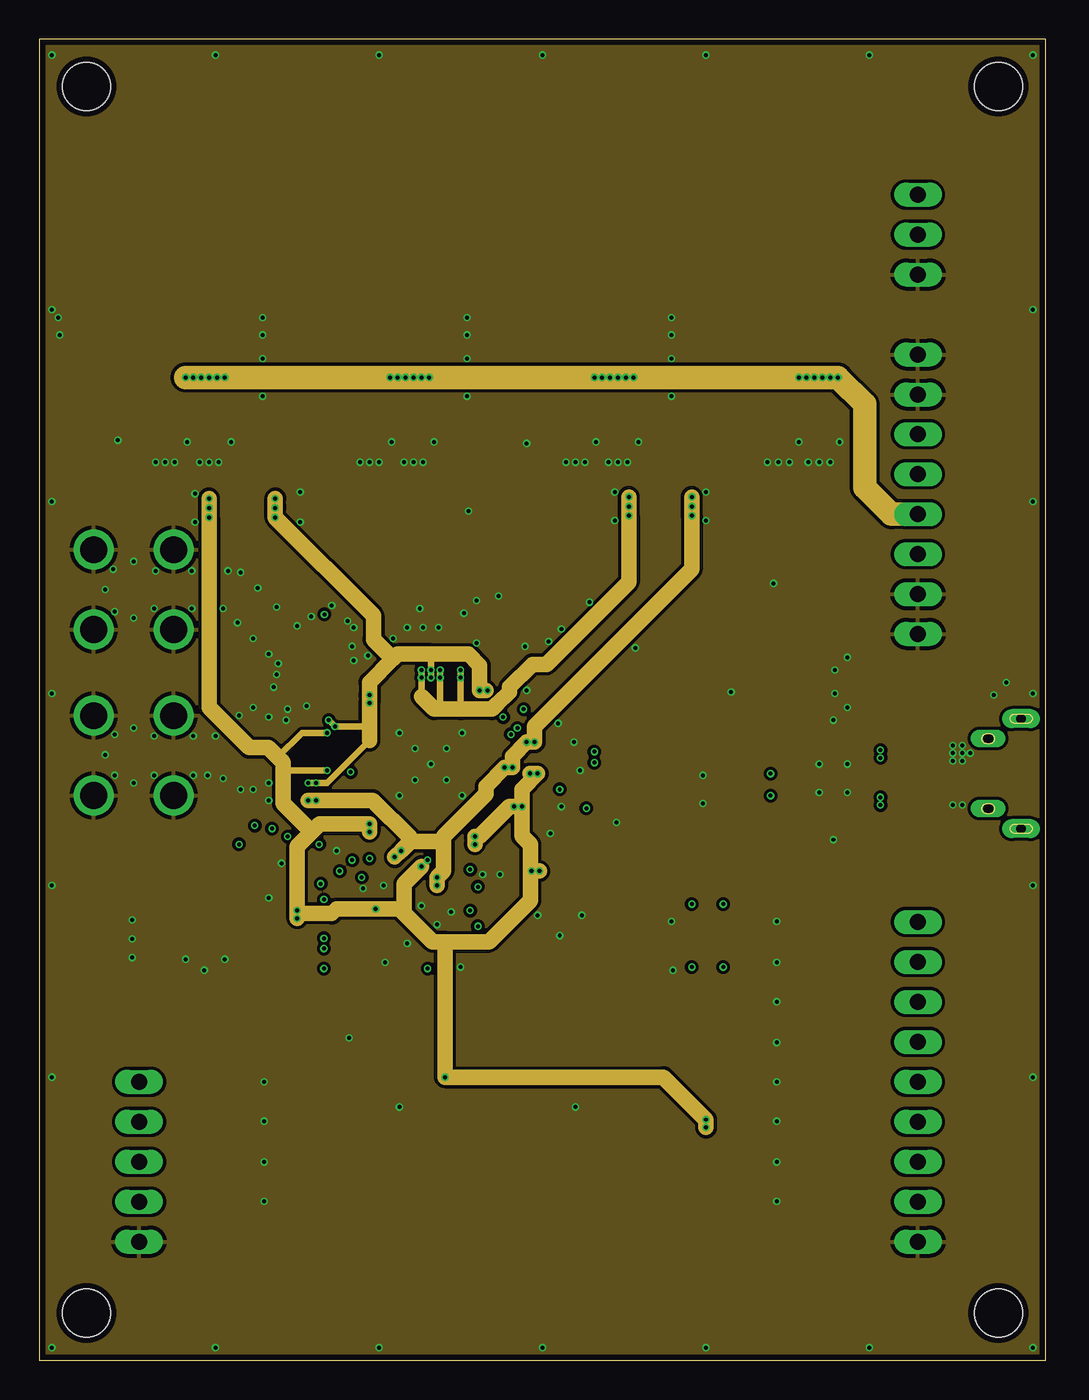
[diagram p5: board, inner layer Route15]
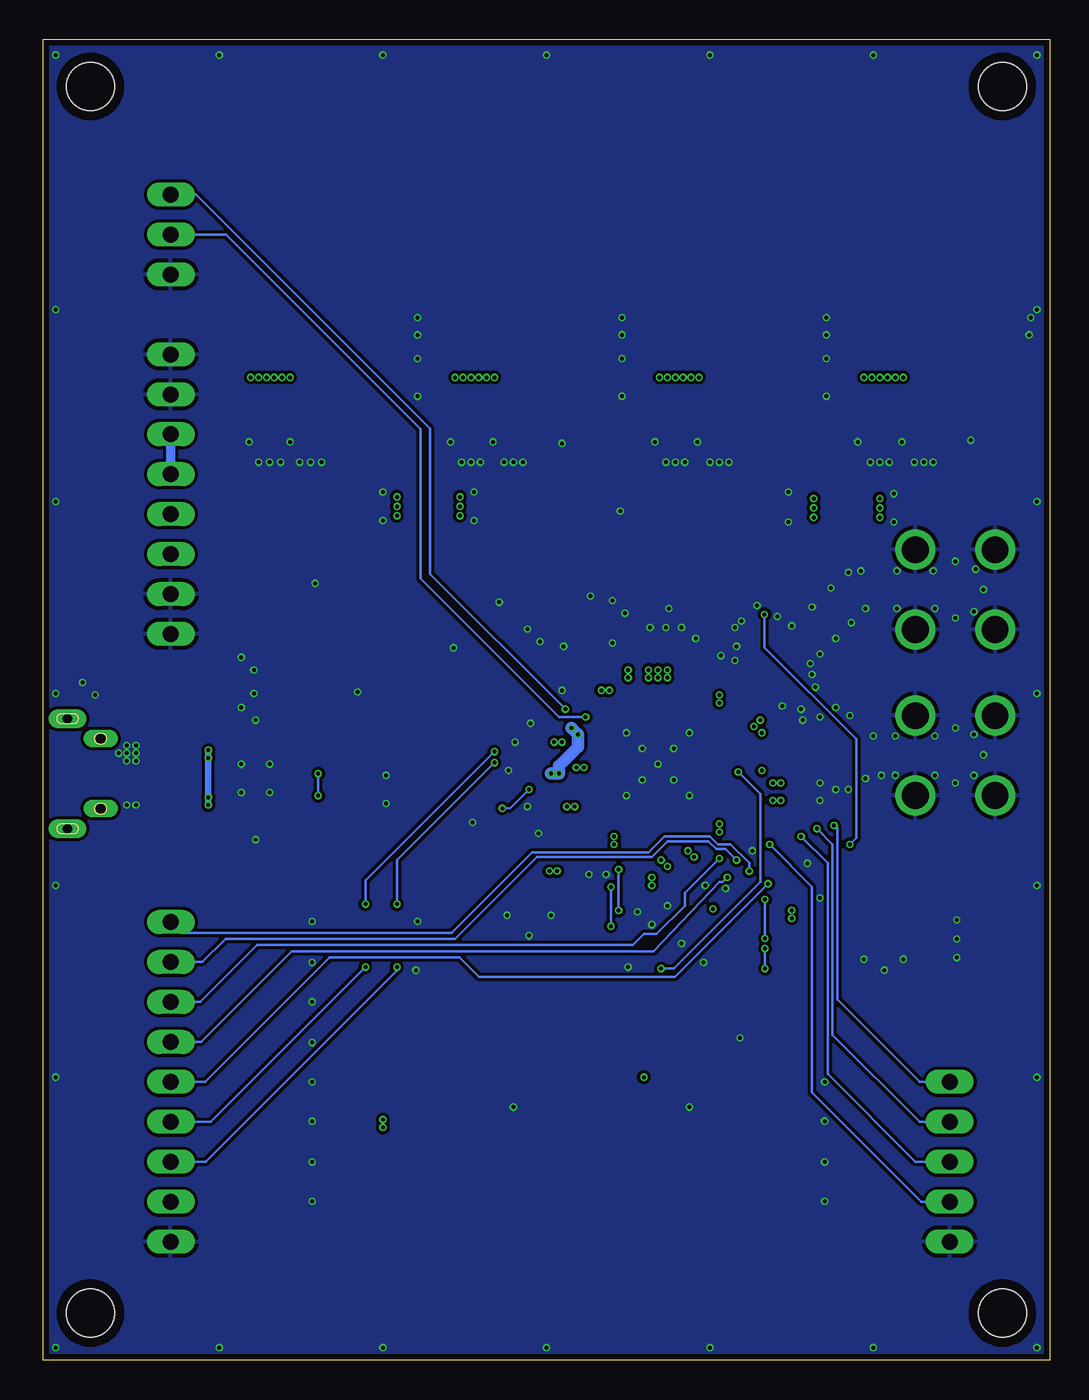
[diagram p6: board, bottom side, seen from below]

Size 64 x 84 mm. Coordinates in mm from the lower left corner, seen from the top.
Outline: 0,0 64,0 64,84 0,84 0,0
Copper layers (1*2*15*16): Top 0.035559375mm / dielectric 0.17018125mm / Route2 0.01778125mm / dielectric 47mil / Route15 0.01778125mm / dielectric 0.17018125mm / Bottom 0.035559375mm
Design rules "oshpark-4layer-tented": minimum track width 5mil, minimum drill 10mil, track to track 5mil, track to pad 5mil, pad to pad 5mil, via to via 5mil, smd to smd 5mil, copper to edge 15mil, drill to drill 6mil, minimum pad ring 4mil, minimum via ring 4mil, stop-mask expansion 2.5mil, vias tented up to drill 20mil, thermal gap 10mil
tRestrict: 4 lines

### Footprints (pad centres in the part's own frame; a part is rotated, then mirrored left to right if it is on the bottom)
C1206 = smd 1.6 x 1.8: 1 -1.4,0; 2 1.4,0
.0402-B-NOSILK = smd 0.6 x 0.7: 1 -0.5,0; 2 0.5,0
.0201-B-NOSILK = smd 0.45 x 0.4: 1 -0.35,0; 2 0.35,0
SOD523 = smd 0.911 x 0.391: 1 -0.725,0; 2 0.725,0
ESD_PGB1010603MR = smd 1.27 x 0.76: 1 -0.89,0; 2 0.89,0
STAND-OFF-TIGHT = hole 3.048: 0,0
CUI_UJ2-MIBH2-4-SMT-TR = smd 0.4 x 1.2: 1 -1.3,2.1; 2 -0.65,2.1; 3 0,2.1; 4 0.65,2.1; 5 1.3,2.1 | drill 0.6 pad 1.2 long: SH1 -3.5,0.55; SH4 3.5,0.55 | drill 0.65 pad 1.1 long: SH2 -2.225,2.65; SH3 2.225,2.65 | smd 3 x 0.9: SH5 0,0.55
HTST-110-01-XX-DV = smd 1.27 x 5.08: 1 -11.43,-3.429; 2 -11.43,3.429; 3 -8.89,-3.429; 4 -8.89,3.429; 5 -6.35,-3.429; 6 -6.35,3.429; 7 -3.81,-3.429; 8 -3.81,3.429; 9 -1.27,-3.429; 10 -1.27,3.429; 11 1.27,-3.429; 12 1.27,3.429; 13 3.81,-3.429; 14 3.81,3.429; 15 6.35,-3.429; 16 6.35,3.429; 17 8.89,-3.429; 18 8.89,3.429; 19 11.43,-3.429; 20 11.43,3.429
AMPHENOL_132134-15 = smd 1.5 x 1.5: 1 0,0 | drill 1.7: P1 -2.54,2.54; P2 2.54,2.54; P3 2.54,-2.54; P4 -2.54,-2.54
1X05 = drill 1.016 long: 1 -5.08,0; 2 -2.54,0; 3 0,0; 4 2.54,0; 5 5.08,0
1X03 = drill 1.016 long: 1 -2.54,0; 2 0,0; 3 2.54,0
1X09 = drill 1.016 long: 1 -10.16,0; 2 -7.62,0; 3 -5.08,0; 4 -2.54,0; 5 0,0; 6 2.54,0; 7 5.08,0; 8 7.62,0; 9 10.16,0
1X08 = drill 1.016 long: 1 -8.89,0; 2 -6.35,0; 3 -3.81,0; 4 -1.27,0; 5 1.27,0; 6 3.81,0; 7 6.35,0; 8 8.89,0
INDC1608X95 = smd 0.85 x 0.7: 1 -0.775,0; 2 0.775,0
LEDC1607X80N = smd 0.9 x 0.85: 1 -0.75,0; 2 0.75,0
.0402-A-NOSILK = smd 0.7 x 0.8: 1 -0.55,0; 2 0.55,0
.0805-B = smd 1.15 x 1.45: 1 -0.9,0; 2 0.9,0
TP06R = smd 0.6 x 0.6: TP 0,0
QFN-68 = smd 0.6 x 0.2: 1 -3.9,3.2; 2 -3.9,2.8; 3 -3.9,2.4; 4 -3.9,2; 5 -3.9,1.6; 6 -3.9,1.2; 7 -3.9,0.8; 8 -3.9,0.4; 9 -3.9,0; 10 -3.9,-0.4; 11 -3.9,-0.8; 12 -3.9,-1.2; 13 -3.9,-1.6; 14 -3.9,-2; 15 -3.9,-2.4; 16 -3.9,-2.8; 17 -3.9,-3.2; 35 3.9,-3.2; 36 3.9,-2.8; 37 3.9,-2.4; 38 3.9,-2; 39 3.9,-1.6; 40 3.9,-1.2; 41 3.9,-0.8; 42 3.9,-0.4; 43 3.9,0; 44 3.9,0.4; 45 3.9,0.8; 46 3.9,1.2; 47 3.9,1.6; 48 3.9,2; 49 3.9,2.4; 50 3.9,2.8; 51 3.9,3.2 | smd 0.2 x 0.6: 18 -3.2,-3.9; 19 -2.8,-3.9; 20 -2.4,-3.9; 21 -2,-3.9; 22 -1.6,-3.9; 23 -1.2,-3.9; 24 -0.8,-3.9; 25 -0.4,-3.9; 26 0,-3.9; 27 0.4,-3.9; 28 0.8,-3.9; 29 1.2,-3.9; 30 1.6,-3.9; 31 2,-3.9; 32 2.4,-3.9; 33 2.8,-3.9; 34 3.2,-3.9; 52 3.2,3.9; 53 2.8,3.9; 54 2.4,3.9; 55 2,3.9; 56 1.6,3.9; 57 1.2,3.9; 58 0.8,3.9; 59 0.4,3.9; 60 0,3.9; 61 -0.4,3.9; 62 -0.8,3.9; 63 -1.2,3.9; 64 -1.6,3.9; 65 -2,3.9; 66 -2.4,3.9; 67 -2.8,3.9; 68 -3.2,3.9 | smd 6.3 x 6.3: 69 0,0
8X = smd 1.411 x 0.351: 1 -2.95,0.975; 2 -2.95,0.325; 3 -2.95,-0.325; 4 -2.95,-0.975; 5 2.95,-0.975; 6 2.95,-0.325; 7 2.95,0.325; 8 2.95,0.975
DDPAK-5_Q = smd 1.067 x 2.286: 1 -3.404,-8.763; 2 -1.702,-8.763; 3 0,-8.763; 4 1.702,-8.763; 5 3.404,-8.763 | smd 10.668 x 8.89: 6 0,0
XTAL_ECS-400-10-36-CKY-TR = smd 1.2 x 1: 1 -0.85,-0.65; 2 0.85,-0.65; 3 0.85,0.65; 4 -0.85,0.65

### Placement (x,y rotation side)
C1  23.8,59.8 270 top
C2  25.4,45.4 90 top
C3  15.9,29.4 180 top
C4  27.8,47 90 top
C5  32.4,47 270 top
C6  24.2,16.1 180 top
C7  17.3,38.9 270 top
C8  16.2,38.5 180 top
C9  14.7,39.3 180 top
C10  14.7,38.5 180 top
C11  13.6,40.4 270 top
C12  13.2,38.5 180 top
C13  12.8,37.4 90 top
C14  12,38.1 270 top
C15  18.11,42.15 135 top
C16  18.61,42.64 135 top
C17  16.56,42.15 225 top
C18  17.55,43.71 135 top
C19  15.99,42.72 225 top
C20  18.83,47.28 45 top
C21  16.49,44.77 135 top
C22  8,59.8 270 top
C23  2.6,65.2 180 top
C24  10.8,59.8 270 top
C25  47,59.8 270 top
C26  41.5,65.2 180 top
C27  19.79,33.29 225 top
C28  24.3,30.2 270 top
C29  28.39,31.8 315 top
C30  33.1,37.5 0 top
C31  31.6,40.5 0 top
C32  31.9,35.2 0 top
C33  24.4,45.4 90 top
C34  21,43.5 90 top
C35  17,40.7 180 top
C36  15.9,36.7 180 top
C37  15.9,35.6 180 top
C38  21.7,31.1 225 top
C39  25.3,29 270 top
C40  32.7,39.3 0 top
C41  23.4,45.4 90 top
C42  27.4,44.8 0 top
C43  61.97,42.29 180 top
C44  51.9,42.4 180 top
C45  51.9,43.9 180 top
C46  49.6,59.8 270 top
C47  21,59.8 270 top
C48  15.5,65.2 180 top
C49  36.8,59.8 270 top
C50  34,59.8 270 top
C51  28.5,65.2 180 top
C52  29.7,42.6 0 top
C53  33.1,29.7 270 top
D1  18.81,45.44 225 top
D2  50.5,35.2 270 top
D3  50.5,38.7 90 top
H1  3,3 0 top
H2  61,3 0 top
H3  3,81 0 top
H4  61,81 0 top
J1  63,37.3 90 top
J3  31,8.4 180 top
J7  6,38.45 90 top
J8  6,49 0 top
JP1  6.35,12.62 270 top
JP2  55.88,71.58 270 top
JP3  55.88,17.7 270 top
JP4  55.88,55.07 270 top
L1  13.6,37.4 90 top
L2  13.2,39.3 180 top
L3  17.06,43.21 135 top
L4  19.14,43.65 225 top
L5  53.5,43.1 90 top
LED1  10.16,17.7 180 top
LED2  10.16,15.16 180 top
LED3  10.16,12.62 180 top
LED4  10.16,10.08 180 top
LED5  52.07,27.86 0 top
LED6  52.07,25.32 0 top
LED7  52.07,22.78 0 top
LED8  52.07,20.24 0 top
LED9  52.07,17.7 0 top
LED10  52.07,15.16 0 top
LED11  52.07,12.62 0 top
LED12  52.07,10.08 0 top
R1  7.3,28 0 top
R2  7.3,26.8 0 top
R3  7.3,25.6 0 top
R4  19,27.4 90 top
R5  20.2,27.4 90 top
R6  21.4,27.4 90 top
R7  25.5,47.8 0 top
R8  36.2,35.1 180 top
R9  22.3,44.4 90 top
R10  25.8,16.7 90 top
R11  12.9,17.7 180 top
R12  27.2,16.7 270 top
R13  32.7,16.1 180 top
R14  31.1,33.5 180 top
R15  12.9,15.16 180 top
R16  12.9,12.62 180 top
R17  12.9,10.08 180 top
R18  48.26,27.86 0 top
R19  48.26,25.32 0 top
R20  48.26,22.78 0 top
R21  48.26,20.24 0 top
R22  48.26,17.7 0 top
R23  48.26,15.16 0 top
R24  48.26,12.62 0 top
R25  48.26,10.08 0 top
R26  17.77,46.22 225 top
R27  2.5,66.3 0 top
R28  41.5,66.3 0 top
R29  29.7,44.6 0 top
R30  15.5,66.3 0 top
R31  28.5,66.3 0 top
R32  5.9,60.3 270 top
R33  18.9,60.3 270 top
R34  44.9,60.2 270 top
R35  31.9,60.3 270 top
R36  12.93,54.2 180 top
R37  39.49,54.28 0 top
TP2  26.7,45.7 0 top
TP3  23.1,42.9 0 top
TP4  22.1,42.9 0 top
TP5  29.7,33.5 0 top
TP6  32.4,48.4 0 top
TP7  59.7,37.95 0 top
U1  24.9,37.9 0 top
U2  13.5,26.5 0 top
U3  8,73 0 top
U4  47,73 0 top
U5  21,73 0 top
U6  34,73 0 top
Y1  30.1,47 0 top

### Tracks (layer width: path | path; a pad name or v marks a point on that pad's centre or on a via)
1V2_A  (via drill 0.25)
  Top 0.2: U1.61 24.5,42.99 24.3,43.19 | U1.59 25.3,42.99 25.5,43.19 v25.5,43.4 v25.5,43.9 25.5,44.2 25.4,44.3 C2.1 | U1.56 26.5,42.7 26.8,43 v26.8,43.4 v26.8,43.9 26.9,44 C42.1 | C41.1 23.4,44.5 24,43.9 v24.3,43.9 v24.3,43.4
  Top 0.203: 24.3,43.19 v24.3,43.4
  Top 0.5: v37.5,54.9 v37.5,54.3 v37.5,53.7
  Top 1: R35.2 31.9,57 34.6,54.3 v37.5,54.3 38.56,54.3 R37.1
  Route15 0.4: v26.8,43.9 v26.8,43.4 26.8,41.4 | v25.5,43.9 v25.5,43.4 25.5,41.79 25.11,41.4 | 24.3,42.21 v24.3,43.4 v24.3,43.9
  Route15 1: v37.5,54.9 v37.5,54.3 v37.5,53.7 37.5,49.49 32.27,44.26 31.36,44.26 29.9,42.8 29.9,42.5 29.16,41.76 29.15,41.76 28.79,41.4 26.8,41.4 25.11,41.4 24.3,42.21
1V2_D  (via drill 0.25)
  Top 0.2: U1.11 20.44,37.1 20.26,36.91 19.01,36.91 17.7,35.6 v17.6,35.6 v17.1,35.6 C37.1 | U1.46 30.8,39.1 v31,39.3 v31.5,39.3 C40.1 | v29.6,37.7 29.4,37.5 U1.42 U1.43 29.4,37.9 v29.6,37.7 | U1.22 23.3,32.7 v23,32.4 v22.6,32 C38.1 | C39.1 v25.3,30.2 v25.3,30.7 U1.27 | v29.6,37.7 v30.1,37.7
  Top 0.5: v41.5,54.9 v41.5,54.3 v41.5,53.7
  Top 1: R34.2 44.9,56.3 42.9,54.3 v41.5,54.3 40.41,54.3 R37.2
  Route15 1: v25.3,30.2 v25.3,30.7 25.7,31.1 25.7,33 | v22.6,32 v23,32.4 23.6,33 | v17.1,35.6 v17.6,35.6 21.2,35.6 23.6,33.2 23.6,33 | 25.7,33 25.7,33.3 28.4,36 28.4,36.5 v29.6,37.7 v30.1,37.7 30.1,38.4 v31,39.3 v31.5,39.3 31.5,40.3 41.5,50.3 v41.5,53.7 v41.5,54.3 v41.5,54.9 | 23.6,33 25.7,33
3V3_A  (via drill 0.25)
  Top 0.2: U1.9 19.4,37.9 18.2,36.7 v17.6,36.7 v17.1,36.7 C36.1 | U1.60 v24.9,43.4 v24.9,43.9 | U1.53 27.7,42.3 v28,42.6 v28.5,42.6 C52.1 | 24.9,44 24.4,44.5 C33.1 | U1.1 v21,41.8 v21,42.3 C34.1 | U1.4 19.2,39.9 v18.8,40.3 v18.4,40.7
  Top 0.203: v18.4,40.7 C35.1 | 24.9,44 v24.9,43.9
  Top 0.5: v15,54.8 v15,54.2 v15,53.6
  Top 1: R33.2 18.9,56.1 17,54.2 v15,54.2 R36.1
  Route15 0.4: 24.9,44.9 v24.9,43.9 v24.9,43.4 | v17.1,36.7 v17.6,36.7 18.3,36.7 21,39.4 | v18.4,40.7 v18.8,40.3 21,40.3
  Route15 1: 22.45,44.55 22.8,44.9 24.9,44.9 27.29,44.9 28,44.19 v28,42.6 28.4,42.6 | 22.45,44.55 21,43.1 v21,42.3 v21,41.8 21,40.3 21,39.4 | v15,54.2 v15,53.6 21.26,47.34 21.26,45.85 22.45,44.65 22.45,44.55 | v15,54.2 15,54.3 | v15,54.2 v15,54.8
3V3_D  (via drill 0.25)
  Top 0.152: v30.2,35.21 v30.2,35.2
  Top 0.2: U1.47 29.7,39.5 v30,39.8 v30.4,40.2 30.7,40.5 C31.1 | U1.37 29.91,35.5 v30.2,35.21 v30.69,35.21 v30.7,35.2 C32.1 | U1.5 18.7,39.5 v18.3,39.9 | U1.41 30.7,37.1 30.9,37.3 v31.2,37.3 v31.7,37.3 32,37.3 32.2,37.5 C30.1 | U1.8 19.1,38.3 v18.3,37.5 | U1.17 v21,34.1 | v21,34.1 20.6,34.1 C27.1 | C3.1 16.4,27.48 U2.8 17.98,27.48 18.45,27.95 R4.2 R5.2 R6.2 v21.4,28.7 | C28.1 v24.3,31.4 v24.7,31.8 24.9,32 U1.26 | C29.1 27.7,32.49 v27.7,32.8 v27.7,33.3 U1.33 | J3.1 42.4,11.86 v42.4,14.8 v42.4,15.3 | v25.8,18 R10.2 | v21,34.1 v21,33.6
  Top 0.5: v10.8,53.6 v10.8,54.2 v10.8,54.8
  Top 1: R32.2 5.9,56.9 8.6,54.2 v10.8,54.2 R36.2 | v31.31,31.11 v31.81,31.11 33.09,31.11 C53.1
  Route15 0.4: v24.7,31.8 v24.3,31.4 | v18.3,39.9 16.7,39.9 15.16,38.36 | 15.5,37.3 15.7,37.5 v18.3,37.5
  Route15 1: v30.7,35.2 v30.2,35.2 29.9,35.2 28,33.3 v27.7,33.3 v27.7,32.8 | 22.9,28.7 23.2,28.7 23.2,30.3 v24.3,31.4 | 22.9,28.7 v21.4,28.7 18.9,28.7 18.6,28.4 16.6,28.4 v16.4,28.6 | 25.8,26.6 v25.8,18 39.7,18 v42.4,15.3 v42.4,14.8 | v16.4,28.1 v16.4,28.6 | 22.9,28.7 25,26.6 25.8,26.6 | v16.4,28.6 16.4,32.69 17.31,33.59 | 17.31,33.59 17.81,34.1 v21,34.1 v21,33.6 | 17.31,33.59 15.5,35.4 15.5,37.3 15.5,38.01 15.16,38.36 14.56,38.96 13.34,38.96 10.8,41.5 v10.8,53.6 v10.8,54.2 | v10.8,54.2 10.8,54.3 | v10.8,54.2 v10.8,54.8 | 31.23,31.1 31.23,29.23 28.6,26.6 25.8,26.6 | 31.23,31.1 31.23,32.8 30.7,33.33 v30.7,35.2 | 31.23,31.1 v31.8,31.1 v31.81,31.11 | v31.2,37.3 v31.7,37.3 30.7,36.3 v30.7,35.2
  Bottom 0.8: v30.4,40.2 v30,39.8 30,39 31.2,37.8 v31.2,37.3 v31.7,37.3
!RST  (via drill 0.25)
  Top 0.152: U1.10 20.4,37.5 20.3,37.4 v19.8,37.4 | R10.1 25.88,16.12 24.73,16.12 C6.1 | C6.1 24.65,16.05 J3.15 | v24.7,24.9 C6.1
  Bottom 0.152: v24.7,24.9 23.9,24.9 18.4,30.4 18.4,36 v19.8,37.4
A1
  Top 0.152: U2.2 7.88,26.82 R2.2
A2
  Top 0.152: U2.3 9.18,26.18 8.6,25.6 R3.2
BIASREF
  Top 0.152: U1.62 24.1,42.7 22.95,43.85 R9.1
CTRL1
  Top 0.152: U1.58 25.7,42.9 26,43.2 26,45.6 26.05,45.65 R7.2
CTRL2
  Top 0.152: U1.57 26.1,42.81 26.3,43.01 26.3,45.3 TP2.TP
EE-SCK  (via drill 0.25)
  Top 0.152: U2.6 v18.1,26.18 19.98,26.18 20.2,26.4 R5.1 | U1.25 24.5,32.3 23.4,31.2 23.4,29.8 22.6,29 22.6,26.7 20.8,24.9 v18.1,24.9
  Bottom 0.152: v18.1,24.9 v18.1,26.18
EE-SDA
  Top 0.152: U2.5 20.52,25.52 21.4,26.4 R6.1 21.95,26.85 22.1,27 22.1,29 23.1,30 23.1,31.3 24.1,32.3 U1.24
EE-WP  (via drill 0.25)
  Top 0.152: U1.23 23.7,32.31 22.79,31.4 22.79,30.2 21.89,29.3 v18.1,29.3 | U2.7 v18.1,26.82 18.98,26.82 R4.1
  Bottom 0.152: v18.1,26.82 v18.1,29.3
GND  (via drill 0.25)
  Top 0.2: C11.1 v13.6,41.5 | C13.1 12.8,36.4 | L1.1 13.6,36.4 | L1.1 14.05,37.05 14.5,36.6 | L1.1 C13.1 | C14.2 12,37.65 | C14.2 12,37 12.75,37 C13.1 | C14.2 11.25,37.75 v10.7,37.2 | C11.1 14.75,40.75 | C11.1 11.45,40.75 | 15.18,41.9 C19.2 15.41,42.8 14.6,42.8 | L4.1 20.2,44.7
  Top 0.4: J1.5 58.2,38.6
  other vias: 12.2,58.4 10.8,57.1 11.4,57.1 10.2,57.1 21.6,57.1 21,57.1 20.4,57.1 24.4,57.1 23.8,57.1 23.2,57.1 37.4,57.1 36.8,57.1 36.2,57.1 34.7,57.1 34.1,57.1 33.5,57.1 47.7,57.1 47,57.1 46.3,57.1 50.3,57.1 49.6,57.1 48.9,57.1 24.9,37.9 32.4,45.7 33.2,46.5 27.8,48.3 27,47.5 29.2,48.6 30.9,45.4 23.4,46.6 24.4,46.6 22.5,45.9 27.8,45.6 25.4,46.6 24.2,47.8 8,57.1 8.6,57.1 7.4,57.1 9.4,58.4 25.1,58.4 22.4,58.4 35.4,58.4 38.1,58.4 48.3,58.4 50.9,58.4 15.4,31.6 18.9,32.4 20.6,30 40.2,65.2 40.2,66.3 27.2,66.3 27.2,65.2 14.2,66.3 14.2,65.2 1.2,66.3 1.3,65.2 0.8,83 63.2,83 11.2,83 21.6,83 32,83 42.4,83 52.8,83 0.8,0.8 63.2,0.8 11.2,0.8 21.6,0.8 32,0.8 42.4,0.8 52.8,0.8 0.8,18 0.8,30.2 0.8,42.4 0.8,54.6 0.8,66.8 63.2,66.8 63.2,54.6 63.2,42.4 63.2,30.2 63.2,18 21.9,30.2 46.9,10.1 46.9,12.6 46.9,15.2 46.9,17.7 46.9,20.2 46.9,22.8 46.9,25.3 46.9,27.9 14.3,10.1 14.3,12.6 14.3,15.2 14.3,17.7 22.9,16.1 5.9,25.6 5.9,26.8 5.9,28 14.6,29.4 11.8,25.5 10.5,24.8 9.3,25.5 34.1,16.1 24.3,28.9 25.3,27.7 26.2,28.5 29.3,30.9 28.2,30.9 32.5,33.5 33.2,35.2 34.4,37.5 34,39.3 33,40.5 31,42.6 20.9,44.8 23.9,38.9 22.9,39.9 25.9,36.9 25.9,38.9 23.9,36.9 22.9,35.9 26.9,39.9 26.9,35.9 14.6,35.6 14.6,36.7 13.6,36.3 11.7,37 12.8,36.3 9.8,37.2 9.8,39.7 11.2,39.7 12.7,41 14.6,40.9 9.7,47.8 9.7,50.2 12,50.2 11.7,47.8 12.6,46.9 13.6,45.9 14.6,44.9 12.8,50.1 13.9,49.1 16.4,46.7 60.7,42.3 61.5,43.1 50.6,42.4 51.4,41.5 51.4,44.7 50.6,43.9 50.5,40.7 50.5,33.1 15.1,47.9 15.2,44.3 15.1,43.6 7.3,39.7 7.3,37.2 6,36.7 4.2,38.5 6,40.2 4.8,39.8 4.8,37.2 7.4,50.2 7.3,47.8 6,47.2 6,50.8 4.2,49 4.7,50.3 4.8,47.6 14.9,42.8 20,46.6 18.6,48 19.6,47 20,44.5 19.9,45.4 17.3,47.3 17,41.6 15.7,40.7 15.8,41.4 36.7,34.2 31.7,28.3 34.5,28.3 33.1,27 59.2,38.6 58.7,38.6 58.7,39.1 58.7,38.1 58.1,38.1 58.1,38.6 58.1,39.1 51.4,36.1 51.4,37.9 49.6,37.9 49.6,36.1 42.2,37.2 42.2,35.4 58.7,35.3 58.1,35.3 37.9,45.3 35,48.2 42.4,53.4 36.6,53.4 42.4,55.2 36.6,55.2 16.6,55.2 16.6,53.3 9.9,55.1 9.9,53.3 5,58.5 31,58.3 14.2,63.7 14.2,61.3 27.2,63.7 27.2,61.3 40.2,63.7 40.2,61.3 27.3,54 23.4,26.5 22,25.3 26.8,25 19.7,20.5 44,42.5 46.7,49.4 40.2,27.9 40.3,24.8
  pour Top (isolate 0.2, rank 6): 0,84 64,84 64,0 0,0
  pour Route2 (isolate 0.2, rank 6): 0,84 64,84 64,0 0,0
  pour Bottom (isolate 0.2, rank 6): 0,84 64,84 64,0 0,0
  pour Route15 (isolate 0.2, rank 6): 0,84 64,84 64,0 0,0
GPIO5  (via drill 0.25)
  Top 0.152: U1.18 21.7,33.4 21.08,32.78 20.27,32.78 19.17,31.68 19.17,31.67 19.1,31.6 v19.1,31.1 | LED5.2 JP3.1
  Bottom 0.152: JP3.1 55.18,27.16 38.04,27.16 32.9,32.3 25.5,32.3 24.5,33.3 21.6,33.3 21.1,32.8 20.29,32.8 19.1,31.61 v19.1,31.1
GPIO6  (via drill 0.25)
  Top 0.152: U1.19 22.1,33.4 21.2,32.5 20.6,32.5 v19.9,31.8 | LED6.2 JP3.2
  Bottom 0.152: JP3.2 53.88,25.32 52.4,26.8 37.8,26.8 32.6,32 25.3,32 24.3,33 21.7,33 21.2,32.5 20.6,32.5 v19.9,31.8
GPIO7  (via drill 0.25)
  Top 0.152: U1.20 22.5,33.4 v21,31.9 | LED7.2 JP3.3
  Bottom 0.152: JP3.3 54.02,22.78 50.4,26.4 26.5,26.4 25.8,27.1 25,27.1 23.2,28.9 23.2,29.7 v21,31.9
GPIO8  (via drill 0.25)
  Top 0.152: U1.21 22.9,33.1 v20.5,30.7 | LED8.2 JP3.4
  Bottom 0.152: JP3.4 53.96,20.24 48.2,26 25.18,26 20.99,30.4 20.8,30.4 v20.5,30.7
GPIO9  (via drill 0.25)
  Top 0.152: v30.8,41.4 v30.79,41.4 29.29,39.9 U1.48
  Bottom 0.152: JP2.1 54.28,74.12 39.4,59.24 39.4,50 v30.8,41.4
GPIO10  (via drill 0.25)
  Top 0.152: U1.49 29.28,40.3 29.5,40.52 v29.5,40.9
  Bottom 0.152: JP2.2 52.38,71.58 40,59.2 40,49.7 31.2,40.9 v29.5,40.9
GPIO11  (via drill 0.25)
  Top 0.152: U1.12 20.47,36.7 20.38,36.61 19.91,36.61 19.53,36.27 18.06,34.8 13.7,34.8 12.2,33.3 12.2,31.2 13.1,30.3 v17.9,30.3 | LED9.2 JP3.5
  Bottom 0.152: JP3.5 53.7,17.7 45.8,25.6 37.51,25.6 36.28,24.37 23.83,24.37 v17.9,30.3
GPIO13  (via drill 0.25)
  Top 0.152: U1.45 v35.3,38.7 | LED10.2 JP3.6 | v43.5,29 v43.5,25
  Bottom 0.152: JP3.6 53.34,15.16 v43.5,25 | v43.5,29 43.5,30.5 v35.3,38.7
GPIO14  (via drill 0.25)
  Top 0.152: v35.3,38 35,38.3 U1.44 | LED11.2 JP3.7 | v41.5,25 v41.5,29
  Bottom 0.152: JP3.7 53.68,12.62 41.5,24.8 v41.5,25 | v41.5,29 41.5,31.8 v35.3,38
GPIO15
  Top 0.152: U1.36 29.36,35.1 30.26,34.2 32.8,34.2 39,28 39,20 46.4,12.6 46.4,9.5 47.3,8.6 52,8.6 52.82,9.42 LED12.2 JP3.8
LDO_IN  (via drill 0.25)
  Route15 1.5: JP4.5 54.2,53.8 52.5,55.5 52.5,60.8 v50.8,62.5 v50.3,62.5 v49.8,62.5 v49.3,62.5 v48.8,62.5 v48.3,62.5 v37.8,62.5 v37.3,62.5 v36.8,62.5 v36.3,62.5 v35.8,62.5 v35.3,62.5 v24.8,62.5 v24.3,62.5 v23.8,62.5 v23.3,62.5 v22.8,62.5 v22.3,62.5 v11.8,62.5 v11.3,62.5 v10.8,62.5 v10.3,62.5 v9.8,62.5 v9.3,62.5
  pour Top (isolate 0.2, no thermals): 50.9,65.3 50.9,60.5 48.1,60.5 48.1,65.3
  pour Top (isolate 0.2, no thermals): 37.9,65.3 37.9,60.5 35.1,60.5 35.1,65.3
  pour Top (isolate 0.2, no thermals): 24.9,65.3 24.9,60.5 22.1,60.5 22.1,65.3
  pour Top (isolate 0.2, no thermals): 11.9,65.3 11.9,60.5 9.1,60.5 9.1,65.3
N$1
  Top 0.2: J1.4 TP7.TP
N$6
  Bottom 0.6: JP4.3 JP4.4
N$7
  Top 0.152: U2.1 9.22,27.48 8.7,28 R1.2
N$12
  Top 0.152: LED1.1
  Top 0.2: R11.2 LED1.1
N$13
  Top 0.2: LED2.1 R15.2
N$14
  Top 0.3: C10.2 C12.1 13.55,38.2 13.6,38.15 L1.2
N$15
  Top 0.38: C15.2 L3.1 | L3.1 | C17.1 17.31,42.9 L3.1
N$17
  Top 0.38: C18.1 C16.2 18.57,43.1 18.6,43.1 L4.2
N$18
  Top 0.3: C9.2 L2.1 13.55,39.65 13.6,39.7 C11.2
N$19
  Top 0.2: R16.2 LED3.1
N$20
  Top 0.2: R17.2 LED4.1
N$21
  Top 0.33: R18.2 LED5.1
N$22
  Top 0.2: C8.2 C10.1
N$23
  Top 0.2: U3.2 6.3,65.65 5.71,66.25 3.1,66.25 R27.2 3.05,65.25 C23.1
N$24
  Top 0.38: C19.1 16.53,43.26 16.61,43.26 L3.2 C18.2 | C21.1 C18.2 | C18.2 17.67,44.33 17.7,44.33 D1.2 18.3,45.19 R26.2
N$25
  Top 0.2: U4.2 45.3,65.6 44.6,66.3 R28.2 42.05,65.25 C26.1
N$26
  Top 0.33: R19.2 LED6.1
N$27
  Top 0.33: R20.2 LED7.1
N$28
  Top 0.305: R21.2 LED8.1
N$29
  Top 0.152: R22.2 LED9.1
N$30
  Top 0.2: 62.47,40.82 J1.SH4
  Top 0.5: C43.1 62.47,40.82 62.47,40.17 61.83,39.52 | J1.SH3 61.83,39.52 | J1.SH1 62.45,34.55 61.92,35.08 | 61.92,35.08 J1.SH2 | 61.83,39.52 62.45,38.9 J1.SH5 62.45,35.6 61.92,35.08
N$33
  Top 1: U3.6 U3.3 C22.1 R32.1
N$34
  Top 0.33: R23.2 LED10.1
N$35
  Top 0.305: R24.2 LED11.1
N$36
  Top 0.33: R25.2 LED12.1
N$37
  Top 1: U4.6 U4.3 C25.1 45,61.2 R34.1
N$43
  Top 0.2: U5.2 19.3,65.6 18.6,66.3 R30.2 16.05,65.25 C48.1
N$44
  Top 1: U5.6 U5.3 C47.1 R33.1
N$46
  Top 0.2: U6.2 32.3,65.6 31.6,66.3 R31.2 29.05,65.25
  Top 0.33: C51.1 29.05,65.25
N$47
  Top 1: R35.1 C50.1 U6.3 U6.6
PDET
  Top 0.152: U1.68 21.7,42.5 TP4.TP
RCV_IN
  Top 0.38: J8.1 12.25,49 C21.2
RFIN_N
  Top 0.2: U1.2 20.55,40.7 C16.1
RFIN_P
  Top 0.2: U1.3 19.96,40.3 C15.1
RFOUT_N
  Top 0.2: C9.1 16.85,39.3 16.9,39.25 C7.1 17.85,39.25 18,39.1 U1.6
RFOUT_P
  Top 0.2: U1.7 17.94,38.7 17.82,38.58 17.33,38.58 C7.2 16.95,38.55 16.9,38.5 C8.1
SPIBOOT
  Top 0.127: R14.2 29.66,33.5 28.85,34.31 28.85,34.7 U1.35
  Top 0.2: TP5.TP 29.66,33.5
SWCOM0  (via drill 0.25)
  Top 0.152: U1.13 20.1,36.3 18.1,34.3 14,34.3 v13.7,34
  Top 0.2: LED1.2 JP1.1
  Bottom 0.152: v13.7,34 13.5,33.8 13.5,22.95 8.25,17.7 JP1.1
SWCOM1  (via drill 0.25)
  Top 0.152: U1.14 20.3,35.9 18.2,33.8 v14.8,33.8
  Top 0.2: JP1.2 LED2.2
  Bottom 0.152: v14.8,33.8 13.8,32.8 13.8,20.7 8.26,15.16 JP1.2
SWCOM2  (via drill 0.25)
  Top 0.152: U1.15 20.52,35.5 18.32,33.3 v15.8,33.3
  Top 0.2: LED3.2 JP1.3
  Bottom 0.152: v15.8,33.3 14.11,31.61 14.11,18.2 8.53,12.62 JP1.3
SWCOM3  (via drill 0.25)
  Top 0.152: U1.16 20.6,35.1 18.3,32.8 v17.8,32.8 v12.7,32.8
  Top 0.2: JP1.4 LED4.2
  Top 0.38: R26.1 C20.1 18.52,47.03 v18.13,47.42
  Bottom 0.152: v17.8,32.8 15.1,30.1 15.1,17.02 8.16,10.08 JP1.4 | v12.7,32.8 12.3,33.2 12.3,39.49 18.13,45.32 v18.13,47.42
TCK  (via drill 0.25)
  Top 0.152: U1.30 26.5,31.2 27.6,30.1 v27.9,30.1 | v27.9,27.6 32.2,23.3 32.2,16.15 R13.2
  Top 0.2: J3.9 32.27,15.98 R13.2
  Bottom 0.152: v27.9,30.1 v27.9,27.6
TDI
  Top 0.152: U1.29 26.1,31.1 37.35,19.85
  Top 0.2: 37.35,19.85 J3.5
TDO
  Top 0.152: R12.2 J3.13
  Top 0.2: J3.13
TDO-PRE-RES  (via drill 0.25)
  Top 0.152: U1.31 26.9,31.4 27.1,31.2 v27.4,31.2 | v27.4,28.6 27.4,18.1 27.2,17.9 R12.1
  Bottom 0.152: v27.4,31.2 v27.4,28.6
TMS
  Top 0.152: U1.28 25.7,31 34.81,21.89 J3.7
TXRTUNE  (via drill 0.25)
  Top 0.133: R8.2 v34.8,35.1
  Top 0.152: v33.1,36.3 U1.39
  Bottom 0.133: v34.8,35.1 34.3,35.1 v33.1,36.3
USB+5V
  Top 0.4: C45.1 52.42,43.88 L5.2
  Top 0.6: JP4.6 54.26,51.26 53.5,50.5 L5.2
USB_+V  (via drill 0.25)
  Top 0.4: C44.1 53.42,42.4 L5.1 v53.5,38.8 v53.5,38.3 | J1.1 53.7,36 v53.5,35.8 v53.5,35.3
  Bottom 0.4: v53.5,38.8 v53.5,35.8 v53.5,35.3
USB_DM
  Top 0.152: U1.40 32.73,36.7 32.81,36.8 33.3,36.8 33.4,36.65 50.5,36.65 | J1.2 50.5,36.65 | D2.1 50.5,36.65
USB_DP  (via drill 0.25)
  Top 0.133: 50.61,37.3 50.5,37.41 D3.1 50.5,37.3
  Top 0.152: v46.51,35.9 33.5,35.9 33.4,35.8 32.8,35.8 32.7,35.9 U1.38 | J1.3 50.61,37.3 | 50.5,37.3 v46.51,37.3
  Bottom 0.152: v46.51,37.3 v46.51,35.9
XMIT_OUT
  Top 0.38: L2.2 C12.2 | C12.2 12.85,38.25 12.8,38.2 C13.2 | C12.2 12.45,38.5 12.4,38.45 C14.1 J7.1
XPABIOS
  Top 0.2: U1.67 22.1,42.2 22.3,42.4 22.6,42.4 TP3.TP
XTALI
  Top 0.152: Y1.1 29.25,45.3 29.15,45.2 R29.1 28.9,44.6 26.9,42.6 U1.55
  Top 0.203: C4.1 28.3,46.5 28.5,46.3 29.2,46.3 Y1.1
XTALO
  Top 0.152: Y1.3 30.25,47.65 30.1,47.5 30.1,45.25 30.25,45.1 R29.2 30.25,44.05 30.1,43.9 28.69,43.9 27.3,42.51 U1.54 | TP6.TP C5.1
  Top 0.203: C5.1 31.8,47.5 31.65,47.65 Y1.3

### Text on the board
tPlace: GPIO9 | GPIO10 | GND | GND | GND | LAB | LAB | PWR | AR9271 Development Board | USB | RX | v1.0 | GND | 2019/11/08 | GND | TX | GPIO5 | GPIO6 | GPIO7 | GPIO8 | SWC0 | GPIO11 | SWC1 | GPIO13 | SWC2 | GPIO14 | SWC3 | GPIO15 | GND | GND